# EAGLE schematic Keyboard (EAGLE 6.3)

## Sheet 1 of 3
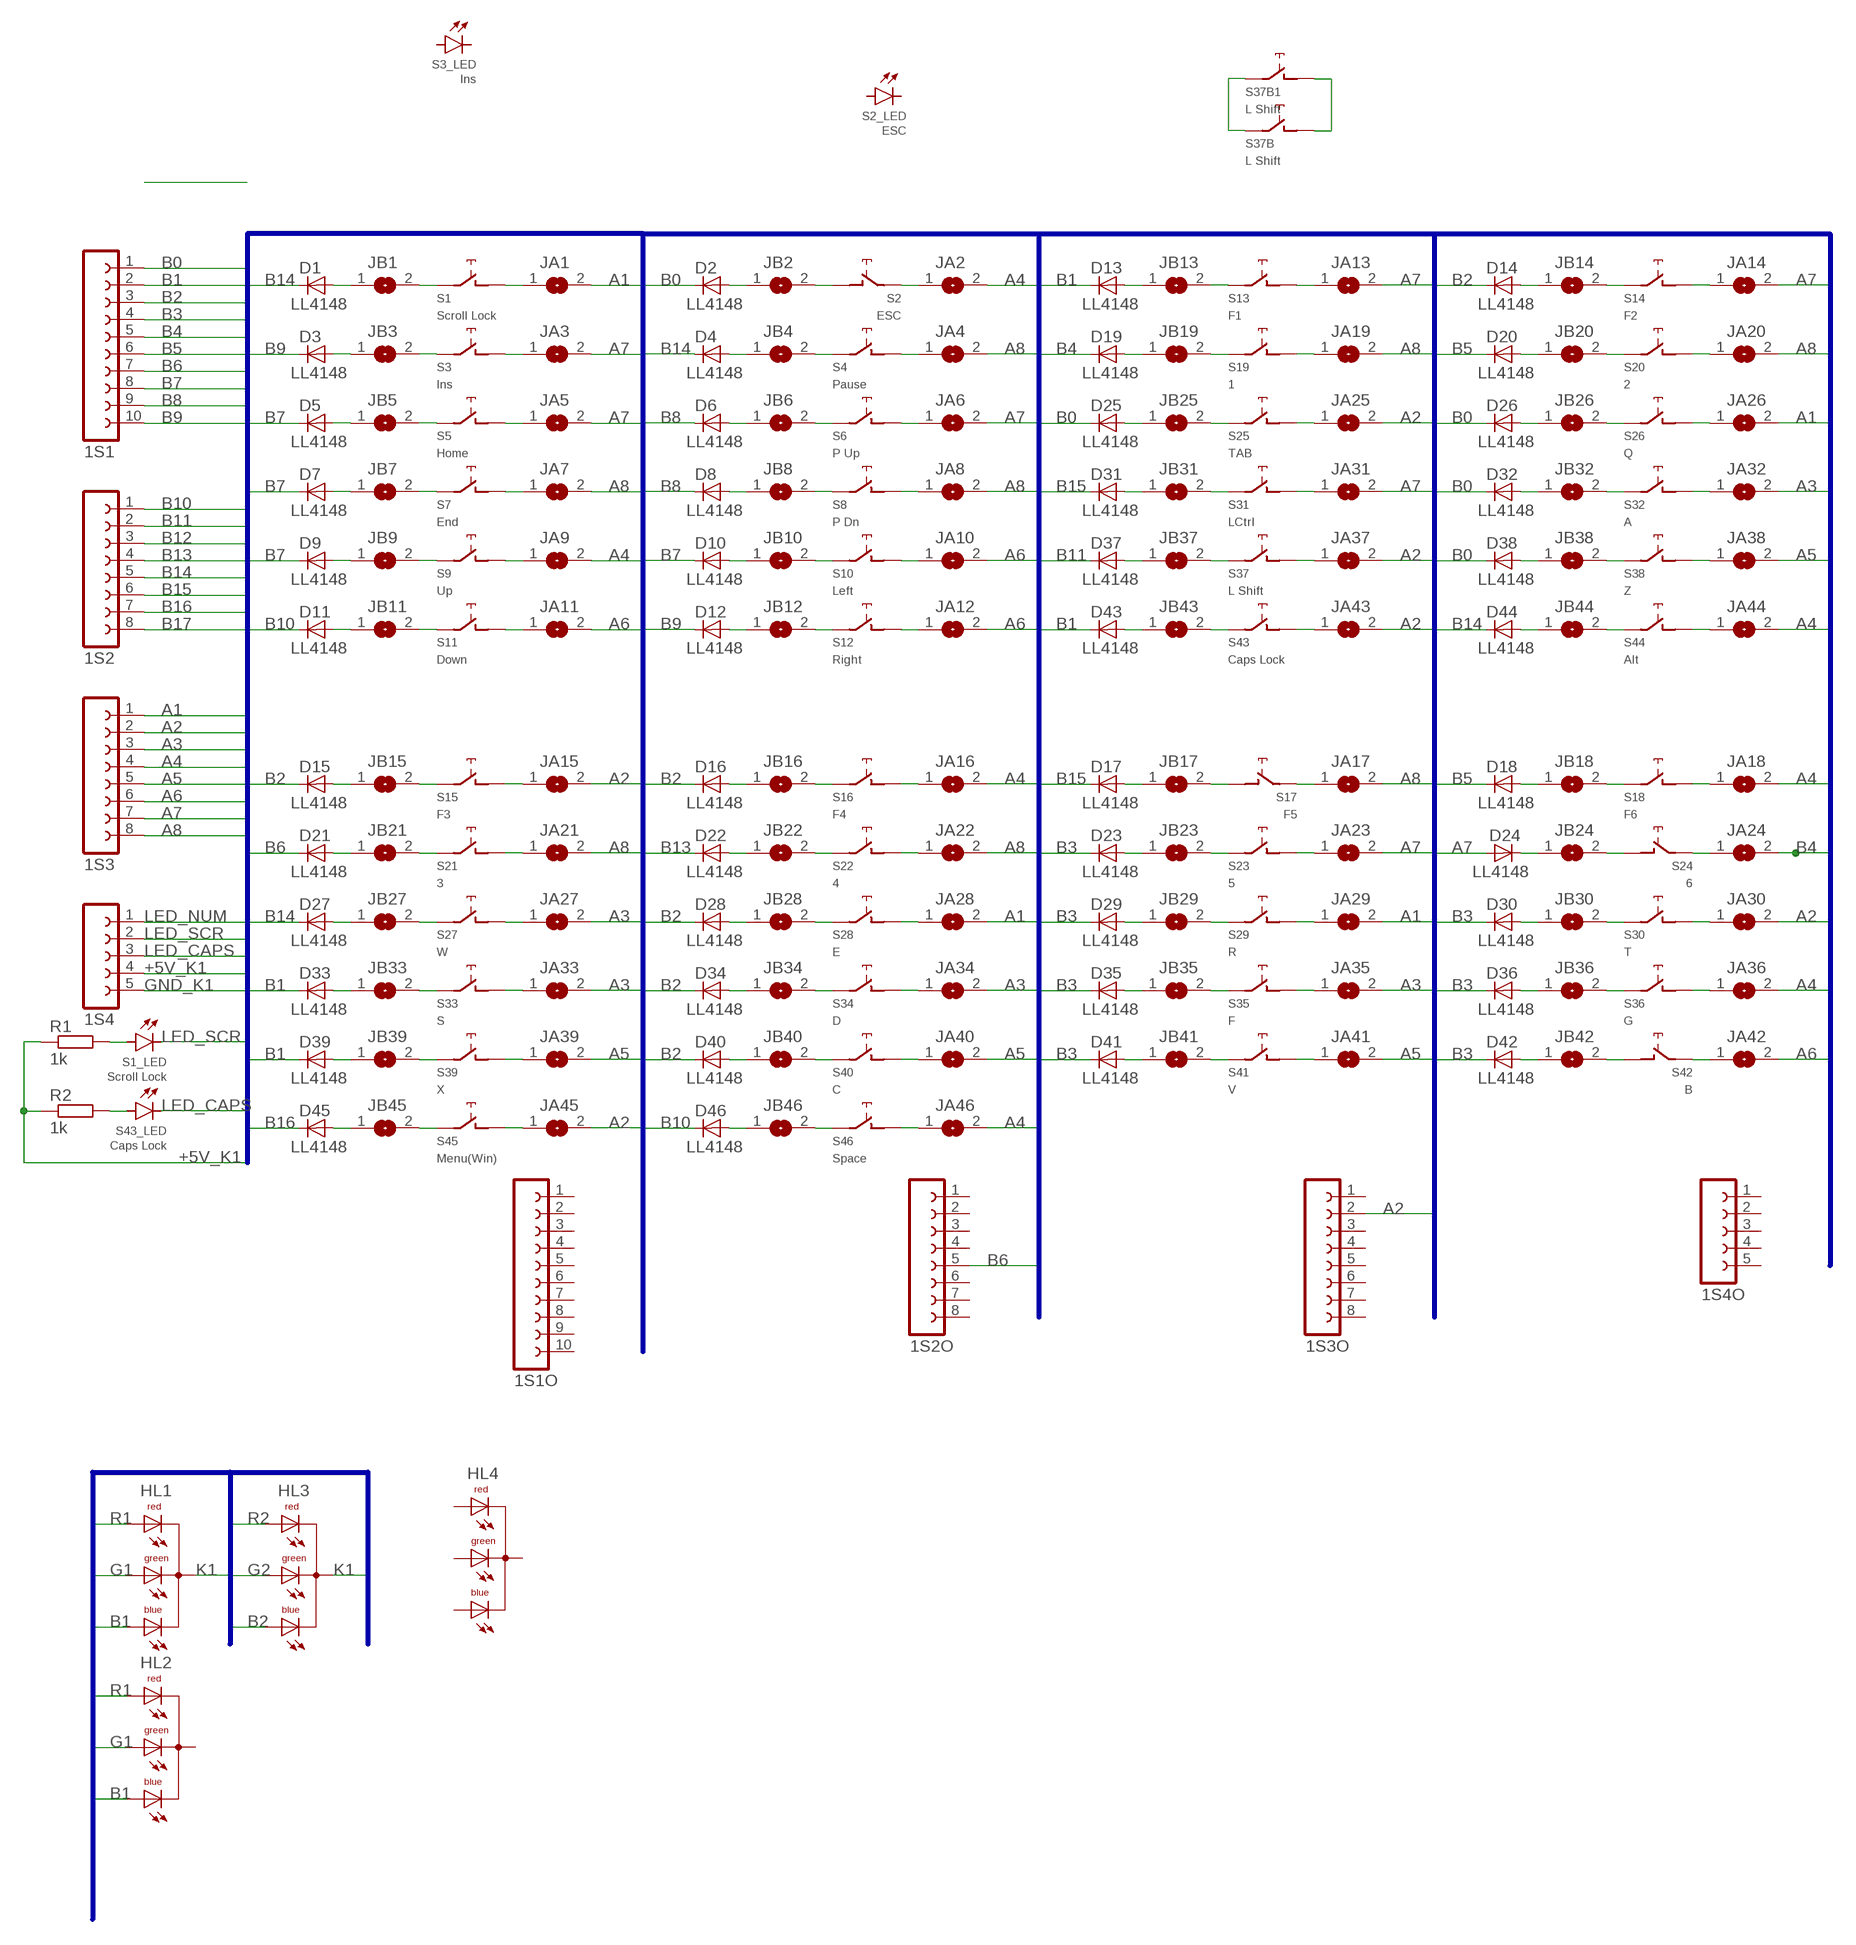
[diagram p0: schematic, sheet 1, part 1 of 2]
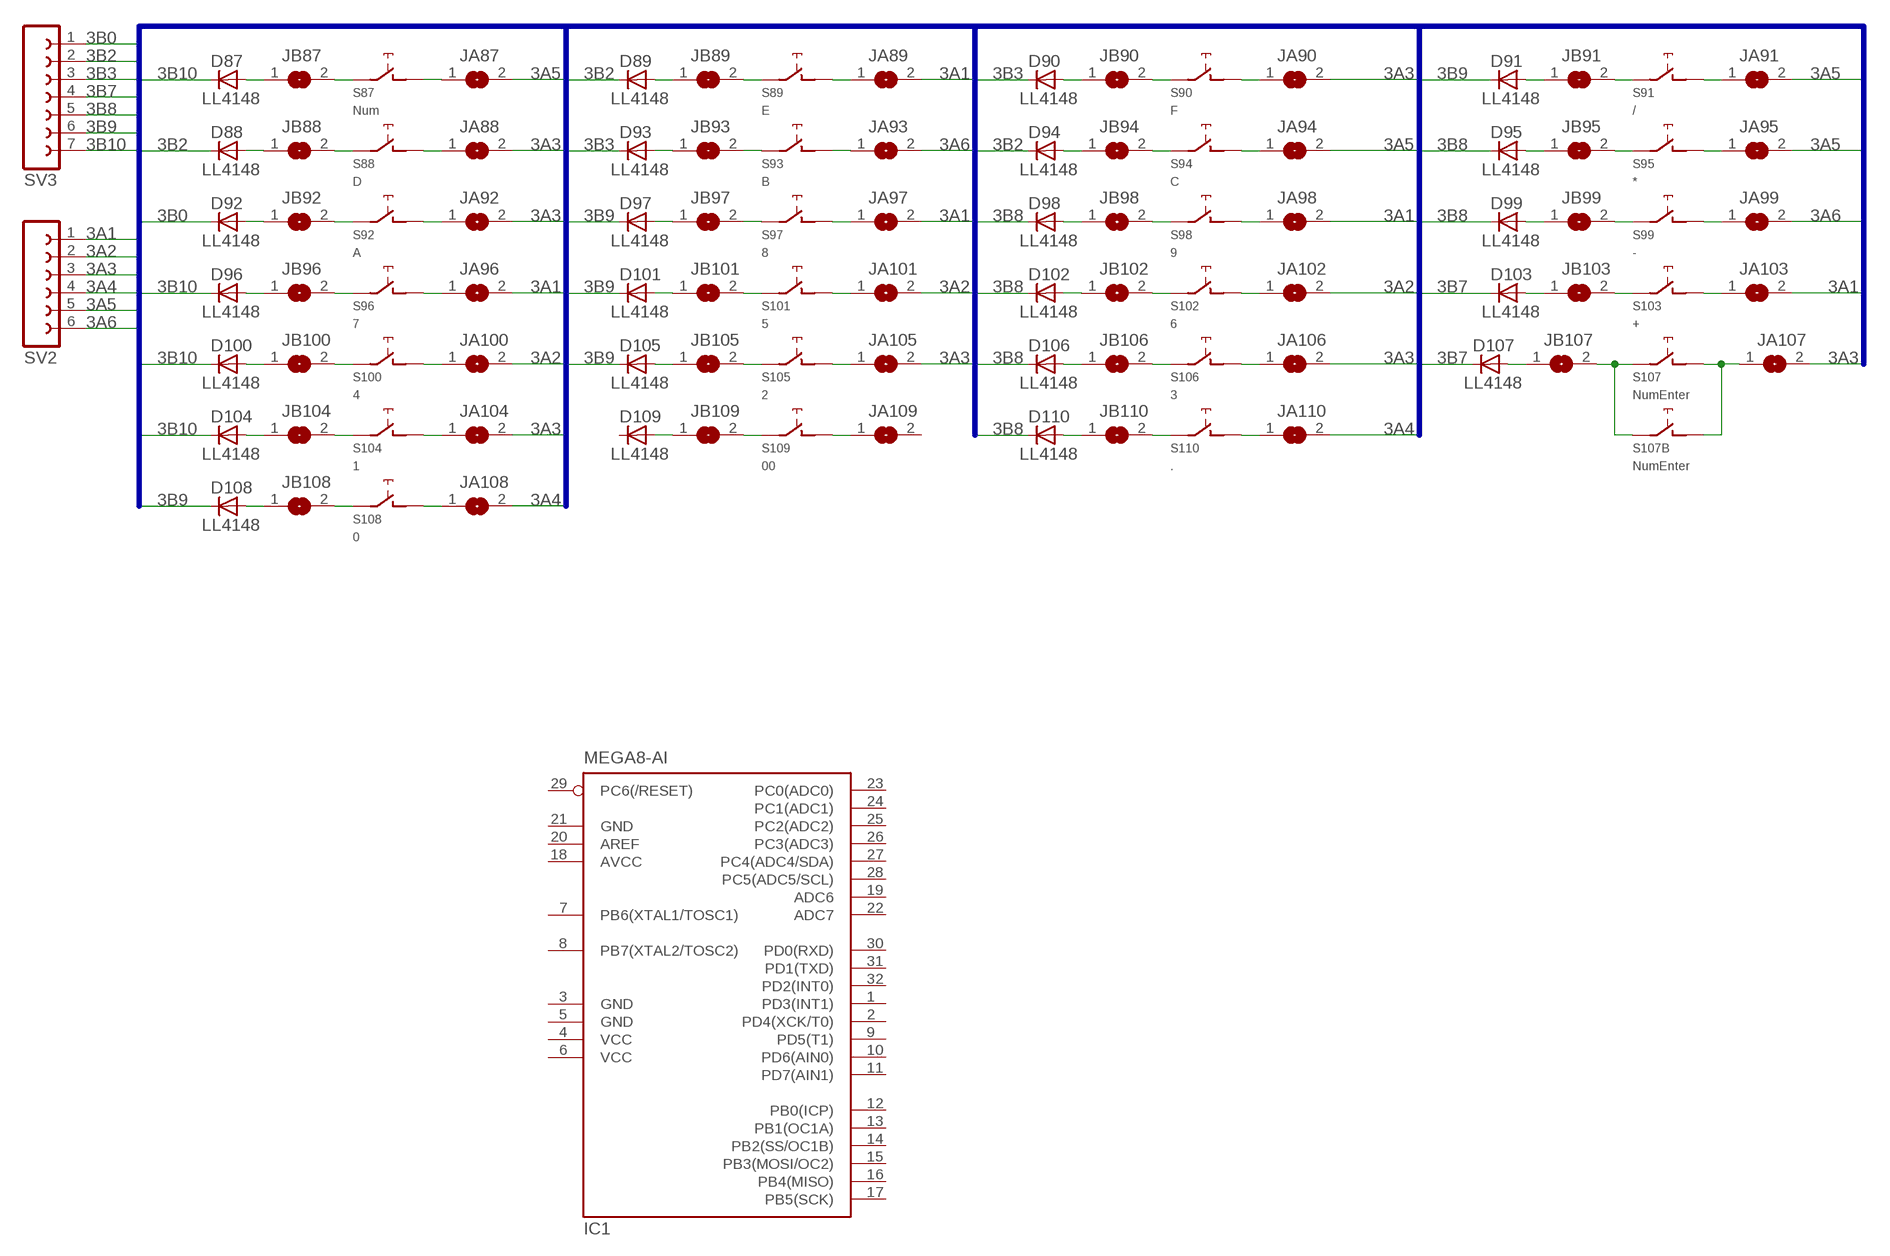
[diagram p1: schematic, sheet 1, part 2 of 2]

### Parts
1S1  FE10-1  [FE10]
1S1O  FE10-1  [FE10]
1S2  FE08-1  [FE08]
1S2O  FE08-1  [FE08]
1S3  FE08-1  [FE08]
1S3O  FE08-1  [FE08]
1S4  FE05-1  [FE05-1]
1S4O  FE05-1  [FE05-1]
D1  LL4148  [SOD80C]
D2  LL4148  [SOD80C]
D3  LL4148  [SOD80C]
D4  LL4148  [SOD80C]
D5  LL4148  [SOD80C]
D6  LL4148  [SOD80C]
D7  LL4148  [SOD80C]
D8  LL4148  [SOD80C]
D9  LL4148  [SOD80C]
D10  LL4148  [SOD80C]
D11  LL4148  [SOD80C]
D12  LL4148  [SOD80C]
D13  LL4148  [SOD80C]
D14  LL4148  [SOD80C]
D15  LL4148  [SOD80C]
D16  LL4148  [SOD80C]
D17  LL4148  [SOD80C]
D18  LL4148  [SOD80C]
D19  LL4148  [SOD80C]
D20  LL4148  [SOD80C]
D21  LL4148  [SOD80C]
D22  LL4148  [SOD80C]
D23  LL4148  [SOD80C]
D24  LL4148  [SOD80C]
D25  LL4148  [SOD80C]
D26  LL4148  [SOD80C]
D27  LL4148  [SOD80C]
D28  LL4148  [SOD80C]
D29  LL4148  [SOD80C]
D30  LL4148  [SOD80C]
D31  LL4148  [SOD80C]
D32  LL4148  [SOD80C]
D33  LL4148  [SOD80C]
D34  LL4148  [SOD80C]
D35  LL4148  [SOD80C]
D36  LL4148  [SOD80C]
D37  LL4148  [SOD80C]
D38  LL4148  [SOD80C]
D39  LL4148  [SOD80C]
D40  LL4148  [SOD80C]
D41  LL4148  [SOD80C]
D42  LL4148  [SOD80C]
D43  LL4148  [SOD80C]
D44  LL4148  [SOD80C]
D45  LL4148  [SOD80C]
D46  LL4148  [SOD80C]
D87  LL4148  [SOD80C]
D88  LL4148  [SOD80C]
D89  LL4148  [SOD80C]
D90  LL4148  [SOD80C]
D91  LL4148  [SOD80C]
D92  LL4148  [SOD80C]
D93  LL4148  [SOD80C]
D94  LL4148  [SOD80C]
D95  LL4148  [SOD80C]
D96  LL4148  [SOD80C]
D97  LL4148  [SOD80C]
D98  LL4148  [SOD80C]
D99  LL4148  [SOD80C]
D100  LL4148  [SOD80C]
D101  LL4148  [SOD80C]
D102  LL4148  [SOD80C]
D103  LL4148  [SOD80C]
D104  LL4148  [SOD80C]
D105  LL4148  [SOD80C]
D106  LL4148  [SOD80C]
D107  LL4148  [SOD80C]
D108  LL4148  [SOD80C]
D109  LL4148  [SOD80C]
D110  LL4148  [SOD80C]
HL1  RGB2X5  [RGB2X5]
HL2  RGB2X5  [RGB2X5]
HL3  RGB2X5  [RGB2X5]
HL4  RGB2X5  [RGB2X5]
IC1  MEGA8-AI  [TQFP32-08]
JA1  SJ  [SJ@1]
JA2  SJ  [SJ@1]
JA3  SJ  [SJ@1]
JA4  SJ  [SJ@1]
JA5  SJ  [SJ@1]
JA6  SJ  [SJ@1]
JA7  SJ  [SJ@1]
JA8  SJ  [SJ@1]
JA9  SJ  [SJ@1]
JA10  SJ  [SJ@1]
JA11  SJ  [SJ@1]
JA12  SJ  [SJ@1]
JA13  SJ  [SJ]
JA14  SJ  [SJ]
JA15  SJ  [SJ]
JA16  SJ  [SJ]
JA17  SJ  [SJ]
JA18  SJ  [SJ]
JA19  SJ  [SJ]
JA20  SJ  [SJ]
JA21  SJ  [SJ]
JA22  SJ  [SJ]
JA23  SJ  [SJ]
JA24  SJ  [SJ]
JA25  SJ  [SJ]
JA26  SJ  [SJ]
JA27  SJ  [SJ]
JA28  SJ  [SJ]
JA29  SJ  [SJ]
JA30  SJ  [SJ]
JA31  SJ  [SJ]
JA32  SJ  [SJ]
JA33  SJ  [SJ]
JA34  SJ  [SJ]
JA35  SJ  [SJ]
JA36  SJ  [SJ]
JA37  SJ  [SJ]
JA38  SJ  [SJ]
JA39  SJ  [SJ]
JA40  SJ  [SJ]
JA41  SJ  [SJ]
JA42  SJ  [SJ]
JA43  SJ  [SJ]
JA44  SJ  [SJ]
JA45  SJ  [SJ]
JA46  SJ  [SJ]
JA87  SJ  [SJ]
JA88  SJ  [SJ]
JA89  SJ  [SJ]
JA90  SJ  [SJ]
JA91  SJ  [SJ]
JA92  SJ  [SJ]
JA93  SJ  [SJ]
JA94  SJ  [SJ]
JA95  SJ  [SJ]
JA96  SJ  [SJ]
JA97  SJ  [SJ]
JA98  SJ  [SJ]
JA99  SJ  [SJ]
JA100  SJ  [SJ]
JA101  SJ  [SJ]
JA102  SJ  [SJ]
JA103  SJ  [SJ]
JA104  SJ  [SJ]
JA105  SJ  [SJ]
JA106  SJ  [SJ]
JA107  SJ  [SJ]
JA108  SJ  [SJ]
JA109  SJ  [SJ]
JA110  SJ  [SJ]
JB1  SJ  [SJ]
JB2  SJ  [SJ@1]
JB3  SJ  [SJ]
JB4  SJ  [SJ@1]
JB5  SJ  [SJ@1]
JB6  SJ  [SJ@1]
JB7  SJ  [SJ@1]
JB8  SJ  [SJ@1]
JB9  SJ  [SJ@1]
JB10  SJ  [SJ@1]
JB11  SJ  [SJ@1]
JB12  SJ  [SJ@1]
JB13  SJ  [SJ@1]
JB14  SJ  [SJ@1]
JB15  SJ  [SJ@1]
JB16  SJ  [SJ@1]
JB17  SJ  [SJ@1]
JB18  SJ  [SJ]
JB19  SJ  [SJ]
JB20  SJ  [SJ]
JB21  SJ  [SJ]
JB22  SJ  [SJ]
JB23  SJ  [SJ]
JB24  SJ  [SJ]
JB25  SJ  [SJ]
JB26  SJ  [SJ]
JB27  SJ  [SJ]
JB28  SJ  [SJ]
JB29  SJ  [SJ]
JB30  SJ  [SJ]
JB31  SJ  [SJ]
JB32  SJ  [SJ]
JB33  SJ  [SJ]
JB34  SJ  [SJ]
JB35  SJ  [SJ]
JB36  SJ  [SJ]
JB37  SJ  [SJ]
JB38  SJ  [SJ]
JB39  SJ  [SJ]
JB40  SJ  [SJ]
JB41  SJ  [SJ]
JB42  SJ  [SJ]
JB43  SJ  [SJ]
JB44  SJ  [SJ]
JB45  SJ  [SJ]
JB46  SJ  [SJ]
JB87  SJ  [SJ]
JB88  SJ  [SJ]
JB89  SJ  [SJ]
JB90  SJ  [SJ]
JB91  SJ  [SJ]
JB92  SJ  [SJ]
JB93  SJ  [SJ]
JB94  SJ  [SJ]
JB95  SJ  [SJ]
JB96  SJ  [SJ]
JB97  SJ  [SJ]
JB98  SJ  [SJ]
JB99  SJ  [SJ]
JB100  SJ  [SJ]
JB101  SJ  [SJ]
JB102  SJ  [SJ]
JB103  SJ  [SJ]
JB104  SJ  [SJ]
JB105  SJ  [SJ]
JB106  SJ  [SJ]
JB107  SJ  [SJ]
JB108  SJ  [SJ]
JB109  SJ  [SJ]
JB110  SJ  [SJ]
R1  1k  R-EU_R1206W  [R1206W]
R2  1k  R-EU_R1206W  [R1206W]
S1  Scroll Lock  CHERRY-MX-LED  [CHERRY-MX-LED]
S2  ESC  CHERRY-MX-LED  [CHERRY-MX-LED]
S3  Ins  CHERRY-MX-LED  [CHERRY-MX-LED]
S4  Pause  CHERRY_MX  [CHERRY-MX@1]
S5  Home  CHERRY-MX  [CHERRY-MX]
S6  P Up  CHERRY-MX  [CHERRY-MX]
S7  End  CHERRY-MX  [CHERRY-MX]
S8  P Dn  CHERRY-MX  [CHERRY-MX]
S9  Up  CHERRY-MX  [CHERRY-MX]
S10  Left  CHERRY-MX  [CHERRY-MX]
S11  Down  CHERRY-MX  [CHERRY-MX]
S12  Right  CHERRY-MX  [CHERRY-MX]
S13  F1  CHERRY-MX  [CHERRY-MX]
S14  F2  CHERRY-MX  [CHERRY-MX]
S15  F3  CHERRY-MX  [CHERRY-MX]
S16  F4  CHERRY-MX  [CHERRY-MX]
S17  F5  CHERRY-MX  [CHERRY-MX]
S18  F6  CHERRY-MX  [CHERRY-MX]
S19  1  CHERRY-MX  [CHERRY-MX]
S20  2  CHERRY-MX  [CHERRY-MX]
S21  3  CHERRY-MX  [CHERRY-MX]
S22  4  CHERRY-MX  [CHERRY-MX]
S23  5  CHERRY-MX  [CHERRY-MX]
S24  6  CHERRY-MX  [CHERRY-MX]
S25  TAB  CHERRY-MX  [CHERRY-MX]
S26  Q  CHERRY-MX  [CHERRY-MX]
S27  W  CHERRY_MX  [CHERRY-MX@1]
S28  E  CHERRY-MX  [CHERRY-MX]
S29  R  CHERRY-MX  [CHERRY-MX]
S30  T  CHERRY-MX  [CHERRY-MX]
S31  LCtrl  CHERRY-MX  [CHERRY-MX]
S32  A  CHERRY-MX  [CHERRY-MX]
S33  S  CHERRY-MX  [CHERRY-MX]
S34  D  CHERRY-MX  [CHERRY-MX]
S35  F  CHERRY-MX  [CHERRY-MX]
S36  G  CHERRY-MX  [CHERRY-MX]
S37  L Shift  CHERRY-MX  [CHERRY-MX]
S37B  L Shift  CHERRY-MX  [CHERRY-MX]
S37B1  L Shift  CHERRY-MX  [CHERRY-MX]
S38  Z  CHERRY-MX  [CHERRY-MX]
S39  X  CHERRY-MX  [CHERRY-MX]
S40  C  CHERRY-MX  [CHERRY-MX]
S41  V  CHERRY-MX  [CHERRY-MX]
S42  B  CHERRY-MX  [CHERRY-MX]
S43  Caps Lock  CHERRY-MX-LED  [CHERRY-MX-LED]
S44  Alt  CHERRY-MX  [CHERRY-MX]
S45  Menu(Win)  CHERRY-MX  [CHERRY-MX]
S46  Space  CHERRY-MX  [CHERRY-MX]
S87  Num  CHERRY-MX-4P  [CHERRY-MX-4P]
S88  D  CHERRY-MX-4P  [CHERRY-MX-4P]
S89  E  CHERRY-MX-4P  [CHERRY-MX-4P]
S90  F  CHERRY-MX-4P  [CHERRY-MX-4P]
S91  /  CHERRY-MX-4P  [CHERRY-MX-4P]
S92  A  CHERRY-MX-4P  [CHERRY-MX-4P]
S93  B  CHERRY-MX-4P  [CHERRY-MX-4P]
S94  C  CHERRY-MX-4P  [CHERRY-MX-4P]
S95  *  CHERRY-MX-4P  [CHERRY-MX-4P]
S96  7  CHERRY-MX-4P  [CHERRY-MX-4P]
S97  8  CHERRY-MX-4P  [CHERRY-MX-4P]
S98  9  CHERRY-MX-4P  [CHERRY-MX-4P]
S99  -  CHERRY-MX-4P  [CHERRY-MX-4P]
S100  4  CHERRY-MX-4P  [CHERRY-MX-4P]
S101  5  CHERRY-MX-4P  [CHERRY-MX-4P]
S102  6  CHERRY-MX-4P  [CHERRY-MX-4P]
S103  +  CHERRY-MX-4P  [CHERRY-MX-4P]
S104  1  CHERRY-MX-4P  [CHERRY-MX-4P]
S105  2  CHERRY-MX-4P  [CHERRY-MX-4P]
S106  3  CHERRY-MX-4P  [CHERRY-MX-4P]
S107  NumEnter  CHERRY-MX-4P  [CHERRY-MX-4P]
S107B  NumEnter  CHERRY-MX  [CHERRY-MX]
S108  0  CHERRY-MX-4P  [CHERRY-MX-4P]
S109  00  CHERRY-MX-4P  [CHERRY-MX-4P]
S110  .  CHERRY-MX-4P  [CHERRY-MX-4P]
SV2  FE06-1  [FE06]
SV3  FE07-1  [FE07]

### Nets
3A1: JA89.2 JA96.2 JA97.2 JA98.2 JA103.2 SV2.1
3A2: JA100.2 JA101.2 JA102.2 SV2.2
3A3: JA88.2 JA90.2 JA92.2 JA104.2 JA105.2 JA106.2 JA107.2 SV2.3
3A4: JA108.2 JA110.2 SV2.4
3A5: JA87.2 JA91.2 JA94.2 JA95.2 SV2.5
3A6: JA93.2 JA99.2 SV2.6
3B0: D92.C SV3.1
3B2: D88.C D89.C D94.C SV3.2
3B3: D90.C D93.C SV3.3
3B7: D103.C D107.C SV3.4
3B8: D95.C D98.C D99.C D102.C D106.C D110.C SV3.5
3B9: D91.C D97.C D101.C D105.C D108.C SV3.6
3B10: D87.C D96.C D100.C D104.C SV3.7
+5V_K1: 1S4.4 R1.1 R2.1
A1: 1S3.1 JA1.2 JA26.2 JA28.2 JA29.2
A2: 1S3.2 1S3O.2 JA15.2 JA25.2 JA30.2 JA37.2 JA43.2 JA45.2
A3: 1S3.3 JA27.2 JA32.2 JA33.2 JA34.2 JA35.2
A4: 1S3.4 JA2.2 JA9.2 JA16.2 JA18.2 JA36.2 JA44.2 JA46.2
A5: 1S3.5 JA38.2 JA39.2 JA40.2 JA41.2
A6: 1S3.6 JA10.2 JA11.2 JA12.2 JA42.2
A7: 1S3.7 D24.A JA3.2 JA5.2 JA6.2 JA13.2 JA14.2 JA23.2 JA31.2
A8: 1S3.8 JA4.2 JA7.2 JA8.2 JA17.2 JA19.2 JA20.2 JA21.2 JA22.2
B0: 1S1.1 D2.C D25.C D26.C D32.C D38.C
B1: 1S1.2 D13.C D33.C D39.C D43.C HL1.4(AB) HL2.4(AB)
B2: 1S1.3 D14.C D15.C D16.C D28.C D34.C D40.C HL3.4(AB)
B3: 1S1.4 D23.C D29.C D30.C D35.C D36.C D41.C D42.C
B4: 1S1.5 D19.C JA24.2
B5: 1S1.6 D18.C D20.C
B6: 1S1.7 1S2O.5 D21.C
B7: 1S1.8 D5.C D7.C D9.C D10.C
B8: 1S1.9 D6.C D8.C
B9: 1S1.10 D3.C D12.C
B10: 1S2.1 D11.C D46.C
B11: 1S2.2 D37.C
B12: 1S2.3
B13: 1S2.4 D22.C
B14: 1S2.5 D1.C D4.C D27.C D44.C
B15: 1S2.6 D17.C D31.C
B16: 1S2.7 D45.C
B17: 1S2.8
G1: HL1.3(AG) HL2.3(AG) ; also sheet 3
G2: HL3.3(AG) ; also sheet 3
GND_K1: 1S4.5
K1: HL1.2(C) HL3.2(C)
LED_CAPS: 1S4.3 S43.LED2(_LED:LED2)
LED_NUM: 1S4.1
LED_SCR: 1S4.2 S1.LED2(_LED:LED2)
N$1: D15.A JB15.1
N$2: JB4.2 S4.SW1(PIN-1)
N$3: D1.A JB1.1
N$4: JA4.1 S4.SW2(PIN-2)
N$5: JB14.2 S14.SW1(PIN-1)
N$6: JB20.2 S20.SW1(PIN-1)
N$7: JB32.2 S32.SW1(PIN-1)
N$8: JB38.2 S38.SW1(PIN-1)
N$9: JB6.2 S6.SW1(PIN-1)
N$10: JA6.1 S6.SW2(PIN-2)
N$11: JA8.1 S8.SW2(PIN-2)
N$12: JB8.2 S8.SW1(PIN-1)
N$13: JB10.2 S10.SW1(PIN-1)
N$14: JB1.2 S1.SW1(PIN-1)
N$15: D2.A JB2.1
N$16: JB2.2 S2.SW2(PIN-2)
N$17: JA2.1 S2.SW1(PIN-1)
N$18: D16.A JB16.1
N$19: JB3.2 S3.SW1(PIN-1)
N$20: JB5.2 S5.SW1(PIN-1)
N$21: JB7.2 S7.SW1(PIN-1)
N$22: JB9.2 S9.SW1(PIN-1)
N$23: JB11.2 S11.SW1(PIN-1)
N$24: D3.A JB3.1
N$25: JB12.2 S12.SW1(PIN-1)
N$26: D5.A JB5.1
N$27: D7.A JB7.1
N$28: JA10.1 S10.SW2(PIN-2)
N$29: JA1.1 S1.SW2(PIN-2)
N$30: D9.A JB9.1
N$31: D11.A JB11.1
N$32: JA3.1 S3.SW2(PIN-2)
N$33: JA5.1 S5.SW2(PIN-2)
N$34: JA7.1 S7.SW2(PIN-2)
N$35: JA9.1 S9.SW2(PIN-2)
N$36: JA11.1 S11.SW2(PIN-2)
N$37: JA12.1 S12.SW2(PIN-2)
N$38: JA14.1 S14.SW2(PIN-2)
N$39: JB13.2 S13.SW1(PIN-1)
N$40: JA13.1 S13.SW2(PIN-2)
N$41: D14.A JB14.1
N$42: JB42.2 S42.SW2(PIN-2)
N$43: JA42.1 S42.SW1(PIN-1)
N$44: JB27.2 S27.SW1(PIN-1)
N$45: JA27.1 S27.SW2(PIN-2)
N$46: JB17.2 S17.SW2(PIN-2)
N$47: JA17.1 S17.SW1(PIN-1)
N$48: D24.C JB24.1
N$49: JB24.2 S24.SW2(PIN-2)
N$50: JA24.1 S24.SW1(PIN-1)
N$51: JA107.1 S107.SW2(PIN-2) S107B.SW2(PIN-2)
N$52: D4.A JB4.1
N$53: D6.A JB6.1
N$54: D8.A JB8.1
N$55: D10.A JB10.1
N$56: D12.A JB12.1
N$57: D13.A JB13.1
N$58: JB19.2 S19.SW1(PIN-1)
N$59: JB25.2 S25.SW1(PIN-1)
N$60: D104.A JB104.1
N$61: JB31.2 S31.SW1(PIN-1)
N$62: JB37.2 S37.SW1(PIN-1) S37B1.SW1(PIN-1) S37B.SW1(PIN-1)
N$63: JB43.2 S43.SW1(PIN-1)
N$64: JB26.2 S26.SW1(PIN-1)
N$65: JB44.2 S44.SW1(PIN-1)
N$66: JB18.2 S18.SW1(PIN-1)
N$68: JB30.2 S30.SW1(PIN-1)
N$69: JB36.2 S36.SW1(PIN-1)
N$72: JB23.2 S23.SW1(PIN-1)
N$73: JB29.2 S29.SW1(PIN-1)
N$74: JB35.2 S35.SW1(PIN-1)
N$75: JB41.2 S41.SW1(PIN-1)
N$76: JB16.2 S16.SW1(PIN-1)
N$77: JB22.2 S22.SW1(PIN-1)
N$78: JB28.2 S28.SW1(PIN-1)
N$79: JB34.2 S34.SW1(PIN-1)
N$80: JB40.2 S40.SW1(PIN-1)
N$81: JB46.2 S46.SW1(PIN-1)
N$82: JB15.2 S15.SW1(PIN-1)
N$83: JB21.2 S21.SW1(PIN-1)
N$85: JB33.2 S33.SW1(PIN-1)
N$86: JB39.2 S39.SW1(PIN-1)
N$87: JB45.2 S45.SW1(PIN-1)
N$88: JA15.1 S15.SW2(PIN-2)
N$90: JA18.1 S18.SW2(PIN-2)
N$91: JA20.1 S20.SW2(PIN-2)
N$92: JA22.1 S22.SW2(PIN-2)
N$93: JA23.1 S23.SW2(PIN-2)
N$95: JA25.1 S25.SW2(PIN-2)
N$96: JA26.1 S26.SW2(PIN-2)
N$98: JA28.1 S28.SW2(PIN-2)
N$99: JA29.1 S29.SW2(PIN-2)
N$100: JA30.1 S30.SW2(PIN-2)
N$101: JA31.1 S31.SW2(PIN-2)
N$102: JA32.1 S32.SW2(PIN-2)
N$103: JA33.1 S33.SW2(PIN-2)
N$104: JA34.1 S34.SW2(PIN-2)
N$105: JA35.1 S35.SW2(PIN-2)
N$106: JA36.1 S36.SW2(PIN-2)
N$107: JA37.1 S37.SW2(PIN-2) S37B1.SW2(PIN-2) S37B.SW2(PIN-2)
N$108: JA38.1 S38.SW2(PIN-2)
N$109: JA39.1 S39.SW2(PIN-2)
N$110: JA40.1 S40.SW2(PIN-2)
N$111: JA41.1 S41.SW2(PIN-2)
N$113: JA43.1 S43.SW2(PIN-2)
N$114: JA45.1 S45.SW2(PIN-2)
N$115: JA46.1 S46.SW2(PIN-2)
N$116: JA19.1 S19.SW2(PIN-2)
N$117: JA44.1 S44.SW2(PIN-2)
N$118: JA21.1 S21.SW2(PIN-2)
N$119: JA16.1 S16.SW2(PIN-2)
N$120: D17.A JB17.1
N$121: D18.A JB18.1
N$122: D19.A JB19.1
N$123: D20.A JB20.1
N$124: D21.A JB21.1
N$125: D22.A JB22.1
N$126: D23.A JB23.1
N$128: D25.A JB25.1
N$129: D26.A JB26.1
N$130: D27.A JB27.1
N$131: D28.A JB28.1
N$132: D29.A JB29.1
N$133: D30.A JB30.1
N$134: D31.A JB31.1
N$135: D32.A JB32.1
N$136: D33.A JB33.1
N$137: D34.A JB34.1
N$138: D35.A JB35.1
N$139: D36.A JB36.1
N$140: D37.A JB37.1
N$141: D38.A JB38.1
N$142: D39.A JB39.1
N$143: D40.A JB40.1
N$144: D41.A JB41.1
N$145: D42.A JB42.1
N$146: D43.A JB43.1
N$147: D44.A JB44.1
N$148: D45.A JB45.1
N$149: D46.A JB46.1
N$150: R1.2 S1.LED1(_LED:LED1)
N$151: R2.2 S43.LED1(_LED:LED1)
N$268: D87.A JB87.1
N$269: D88.A JB88.1
N$270: JB87.2 S87.SW1(PIN-1)
N$271: JB88.2 S88.SW1(PIN-1)
N$272: JA87.1 S87.SW2(PIN-2)
N$273: JA88.1 S88.SW2(PIN-2)
N$274: D89.A JB89.1
N$275: JB89.2 S89.SW1(PIN-1)
N$276: JA89.1 S89.SW2(PIN-2)
N$277: D90.A JB90.1
N$278: JB90.2 S90.SW1(PIN-1)
N$279: JA90.1 S90.SW2(PIN-2)
N$280: D91.A JB91.1
N$281: JB91.2 S91.SW1(PIN-1)
N$282: JA91.1 S91.SW2(PIN-2)
N$283: JB92.2 S92.SW1(PIN-1)
N$284: D92.A JB92.1
N$285: JA92.1 S92.SW2(PIN-2)
N$286: JA93.1 S93.SW2(PIN-2)
N$287: JB93.2 S93.SW1(PIN-1)
N$288: D93.A JB93.1
N$289: D94.A JB94.1
N$290: JB94.2 S94.SW1(PIN-1)
N$291: JA94.1 S94.SW2(PIN-2)
N$292: D95.A JB95.1
N$293: JB95.2 S95.SW1(PIN-1)
N$294: JA95.1 S95.SW2(PIN-2)
N$295: D96.A JB96.1
N$296: JB96.2 S96.SW1(PIN-1)
N$297: JA96.1 S96.SW2(PIN-2)
N$298: JB97.2 S97.SW1(PIN-1)
N$299: JA97.1 S97.SW2(PIN-2)
N$300: D97.A JB97.1
N$301: D98.A JB98.1
N$302: JB98.2 S98.SW1(PIN-1)
N$303: JA98.1 S98.SW2(PIN-2)
N$304: D99.A JB99.1
N$305: JB99.2 S99.SW1(PIN-1)
N$306: JA99.1 S99.SW2(PIN-2)
N$307: D100.A JB100.1
N$308: JB100.2 S100.SW1(PIN-1)
N$309: JA100.1 S100.SW2(PIN-2)
N$310: JB101.2 S101.SW1(PIN-1)
N$311: D101.A JB101.1
N$312: JA101.1 S101.SW2(PIN-2)
N$313: D102.A JB102.1
N$314: JB102.2 S102.SW1(PIN-1)
N$315: JA102.1 S102.SW2(PIN-2)
N$316: D103.A JB103.1
N$317: JB103.2 S103.SW1(PIN-1)
N$318: JA103.1 S103.SW2(PIN-2)
N$319: JB107.2 S107.SW1(PIN-1) S107B.SW1(PIN-1)
N$320: JB104.2 S104.SW1(PIN-1)
N$321: JA104.1 S104.SW2(PIN-2)
N$322: JB105.2 S105.SW1(PIN-1)
N$323: D105.A JB105.1
N$324: JA105.1 S105.SW2(PIN-2)
N$325: D106.A JB106.1
N$326: JB106.2 S106.SW1(PIN-1)
N$327: JA106.1 S106.SW2(PIN-2)
N$328: D107.A JB107.1
N$329: JB108.2 S108.SW1(PIN-1)
N$330: JA108.1 S108.SW2(PIN-2)
N$331: D108.A JB108.1
N$332: JB109.2 S109.SW1(PIN-1)
N$333: D109.A JB109.1
N$334: JA109.1 S109.SW2(PIN-2)
N$335: D110.A JB110.1
N$336: JB110.2 S110.SW1(PIN-1)
N$337: JA110.1 S110.SW2(PIN-2)
R1: HL1.1(AR) HL2.1(AR)
R2: HL3.1(AR)
Unconnected: 1S1O.1 1S1O.2 1S1O.3 1S1O.4 1S1O.5 1S1O.6 1S1O.7 1S1O.8 1S1O.9 1S1O.10 1S2O.1 1S2O.2 1S2O.3 1S2O.4 1S2O.6 1S2O.7 1S2O.8 1S3O.1 1S3O.3 1S3O.4 1S3O.5 1S3O.6 1S3O.7 1S3O.8 1S4O.1 1S4O.2 1S4O.3 1S4O.4 1S4O.5 D109.C HL2.2(C) HL4.1(AR) HL4.2(C) HL4.3(AG) HL4.4(AB) IC1.1(PD3(INT1)) IC1.2(PD4(XCK/T0)) IC1.7(PB6(XTAL1/TOSC1)) IC1.8(PB7(XTAL2/TOSC2)) IC1.9(PD5(T1)) IC1.10(PD6(AIN0)) IC1.11(PD7(AIN1)) IC1.12(PB0(ICP)) IC1.13(PB1(OC1A)) IC1.14(PB2(SS/OC1B)) IC1.15(PB3(MOSI/OC2)) IC1.16(PB4(MISO)) IC1.17(PB5(SCK)) IC1.19(ADC6) IC1.20(AREF) IC1.22(ADC7) IC1.23(PC0(ADC0)) IC1.24(PC1(ADC1)) IC1.25(PC2(ADC2)) IC1.26(PC3(ADC3)) IC1.27(PC4(ADC4/SDA)) IC1.28(PC5(ADC5/SCL)) IC1.29(PC6(/RESET)) IC1.30(PD0(RXD)) IC1.31(PD1(TXD)) IC1.32(PD2(INT0)) JA109.2 S2.LED1(_LED:LED1) S2.LED2(_LED:LED2) S3.LED1(_LED:LED1) S3.LED2(_LED:LED2) S87.D1(_D:D1) S87.D2(_D:D2) S87.LED1(_L:LED1) S87.LED2(_L:LED2) S88.D1(_D:D1) S88.D2(_D:D2) S88.LED1(_L:LED1) S88.LED2(_L:LED2) S89.D1(_D:D1) S89.D2(_D:D2) S89.LED1(_L:LED1) S89.LED2(_L:LED2) S90.D1(_D:D1) S90.D2(_D:D2) S90.LED1(_L:LED1) S90.LED2(_L:LED2) S91.D1(_D:D1) S91.D2(_D:D2) S91.LED1(_L:LED1) S91.LED2(_L:LED2) S92.D1(_D:D1) S92.D2(_D:D2) S92.LED1(_L:LED1) S92.LED2(_L:LED2) S93.D1(_D:D1) S93.D2(_D:D2) S93.LED1(_L:LED1) S93.LED2(_L:LED2) S94.D1(_D:D1) S94.D2(_D:D2) S94.LED1(_L:LED1) S94.LED2(_L:LED2) S95.D1(_D:D1) S95.D2(_D:D2) S95.LED1(_L:LED1) S95.LED2(_L:LED2) S96.D1(_D:D1) S96.D2(_D:D2) S96.LED1(_L:LED1) S96.LED2(_L:LED2) S97.D1(_D:D1) S97.D2(_D:D2) S97.LED1(_L:LED1) S97.LED2(_L:LED2) S98.D1(_D:D1) S98.D2(_D:D2) S98.LED1(_L:LED1) S98.LED2(_L:LED2) S99.D1(_D:D1) S99.D2(_D:D2) S99.LED1(_L:LED1) S99.LED2(_L:LED2) S100.D1(_D:D1) S100.D2(_D:D2) S100.LED1(_L:LED1) S100.LED2(_L:LED2) S101.D1(_D:D1) S101.D2(_D:D2) S101.LED1(_L:LED1) S101.LED2(_L:LED2) S102.D1(_D:D1) S102.D2(_D:D2) S102.LED1(_L:LED1) S102.LED2(_L:LED2) S103.D1(_D:D1) S103.D2(_D:D2) S103.LED1(_L:LED1) S103.LED2(_L:LED2) S104.D1(_D:D1) S104.D2(_D:D2) S104.LED1(_L:LED1) S104.LED2(_L:LED2) S105.D1(_D:D1) S105.D2(_D:D2) S105.LED1(_L:LED1) S105.LED2(_L:LED2) S106.D1(_D:D1) S106.D2(_D:D2) S106.LED1(_L:LED1) S106.LED2(_L:LED2) S107.D1(_D:D1) S107.D2(_D:D2) S107.LED1(_L:LED1) S107.LED2(_L:LED2) S108.D1(_D:D1) S108.D2(_D:D2) S108.LED1(_L:LED1) S108.LED2(_L:LED2) S109.D1(_D:D1) S109.D2(_D:D2) S109.LED1(_L:LED1) S109.LED2(_L:LED2) S110.D1(_D:D1) S110.D2(_D:D2) S110.LED1(_L:LED1) S110.LED2(_L:LED2)

### Buses
A[1..8],B[0..17],LED_NUM,LED_CAPS,LED_SCR,+5V_K1,GND_K1
3A[1..8],3B[0..17],3LED_NUM,3LED_CAPS,3LED_SCR,+5V_K3,GND_K3
R[1..8],G[1..8],B[1..8],K[1..8]

## Sheet 2 of 3
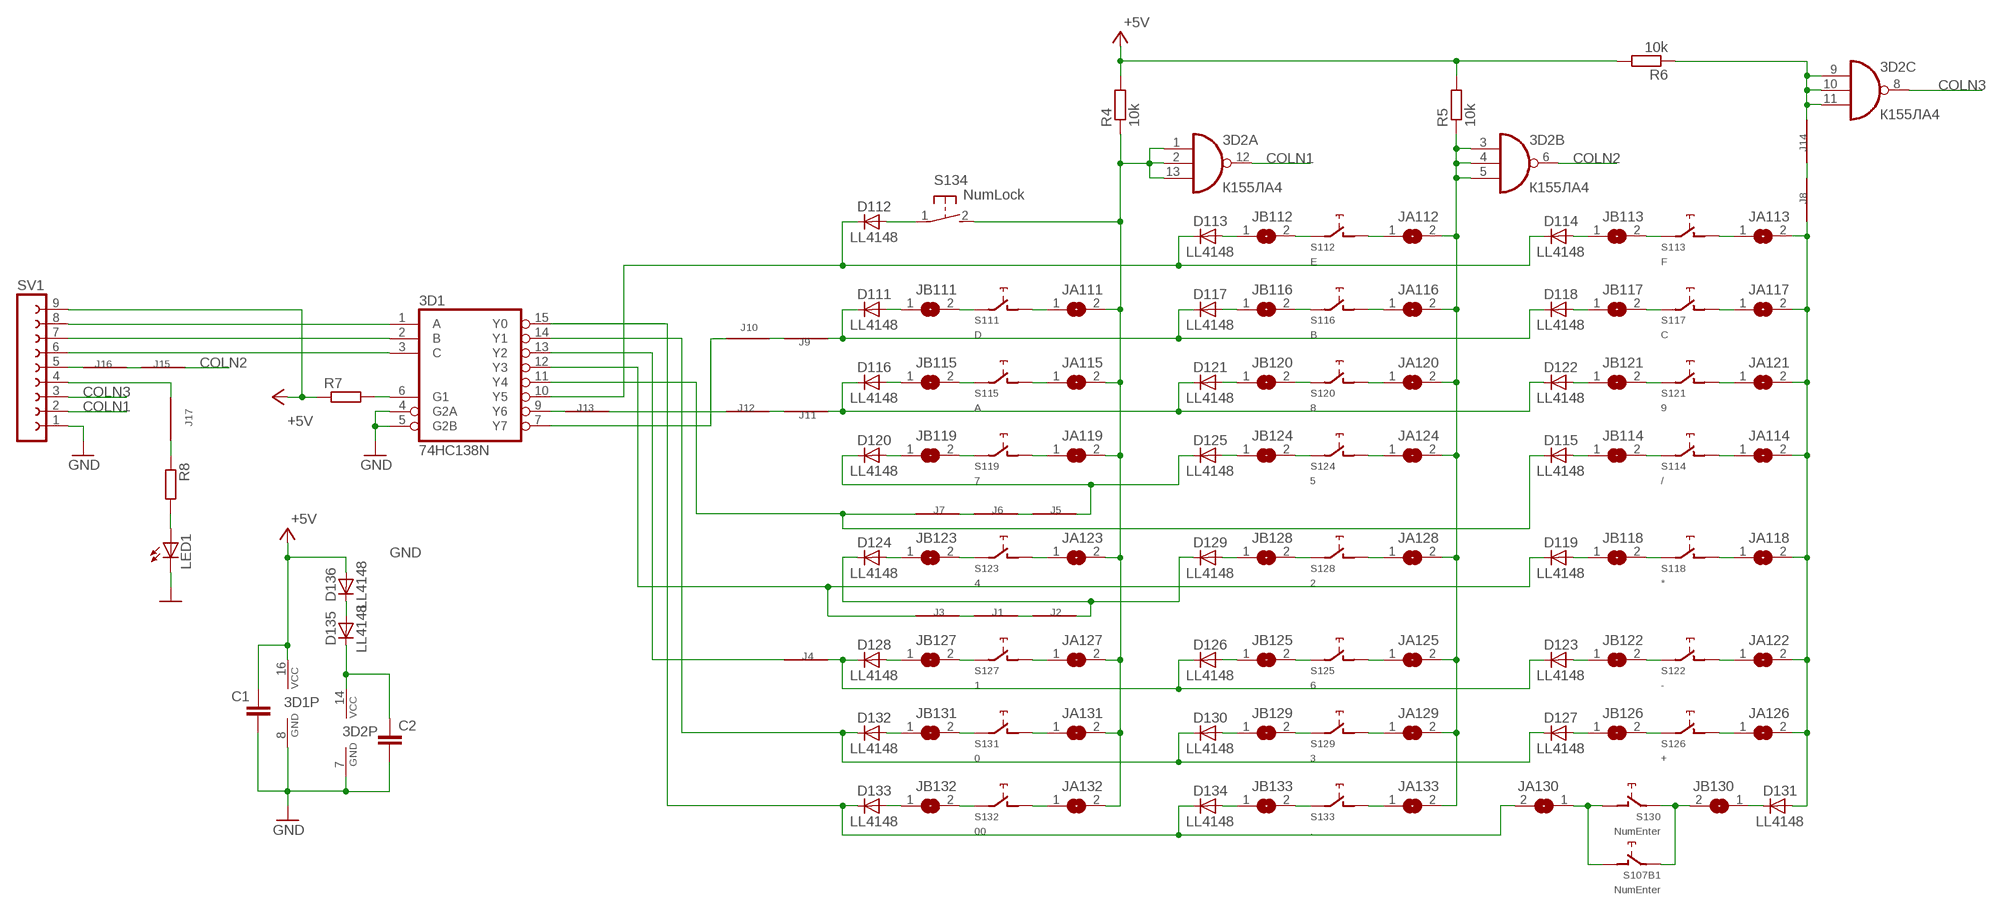
[diagram p2: schematic, sheet 2]

### Parts
3D1  74HC138N  [DIL16]
3D2  К155ЛА4  74HC10N  [DIL14]
C1  C-EUC1206  [C1206]
C2  C-EUC1206  [C1206]
D111  LL4148  [SOD80C]
D112  LL4148  [SOD80C]
D113  LL4148  [SOD80C]
D114  LL4148  [SOD80C]
D115  LL4148  [SOD80C]
D116  LL4148  [SOD80C]
D117  LL4148  [SOD80C]
D118  LL4148  [SOD80C]
D119  LL4148  [SOD80C]
D120  LL4148  [SOD80C]
D121  LL4148  [SOD80C]
D122  LL4148  [SOD80C]
D123  LL4148  [SOD80C]
D124  LL4148  [SOD80C]
D125  LL4148  [SOD80C]
D126  LL4148  [SOD80C]
D127  LL4148  [SOD80C]
D128  LL4148  [SOD80C]
D129  LL4148  [SOD80C]
D130  LL4148  [SOD80C]
D131  LL4148  [SOD80C]
D132  LL4148  [SOD80C]
D133  LL4148  [SOD80C]
D134  LL4148  [SOD80C]
D135  LL4148  [SOD80C]
D136  LL4148  [SOD80C]
J1  J  [R1206W]
J2  J  [R1206W]
J3  J  [R1206W]
J4  J  [R1206W]
J5  J  [R1206W]
J6  J  [R1206W]
J7  J  [R1206W]
J8  J  [R1206W]
J9  J  [R1206W]
J10  J  [R1206W]
J11  J  [R1206W]
J12  J  [R1206W]
J13  J  [R1206W]
J14  J  [R1206W]
J15  J  [R1206W]
J16  J  [R1206W]
J17  J  [R1206W]
JA111  SJ  [SJ]
JA112  SJ  [SJ]
JA113  SJ  [SJ]
JA114  SJ  [SJ]
JA115  SJ  [SJ]
JA116  SJ  [SJ]
JA117  SJ  [SJ]
JA118  SJ  [SJ]
JA119  SJ  [SJ]
JA120  SJ  [SJ]
JA121  SJ  [SJ]
JA122  SJ  [SJ]
JA123  SJ  [SJ]
JA124  SJ  [SJ]
JA125  SJ  [SJ]
JA126  SJ  [SJ]
JA127  SJ  [SJ]
JA128  SJ  [SJ]
JA129  SJ  [SJ]
JA130  SJ  [SJ]
JA131  SJ  [SJ]
JA132  SJ  [SJ]
JA133  SJ  [SJ]
JB111  SJ  [SJ]
JB112  SJ  [SJ]
JB113  SJ  [SJ]
JB114  SJ  [SJ]
JB115  SJ  [SJ]
JB116  SJ  [SJ]
JB117  SJ  [SJ]
JB118  SJ  [SJ]
JB119  SJ  [SJ]
JB120  SJ  [SJ]
JB121  SJ  [SJ]
JB122  SJ  [SJ]
JB123  SJ  [SJ]
JB124  SJ  [SJ]
JB125  SJ  [SJ]
JB126  SJ  [SJ]
JB127  SJ  [SJ]
JB128  SJ  [SJ]
JB129  SJ  [SJ]
JB130  SJ  [SJ]
JB131  SJ  [SJ]
JB132  SJ  [SJ]
JB133  SJ  [SJ]
LED1  LED5MM  [LED5MM]
R4  10k  R-EU_R1206W  [R1206W]
R5  10k  R-EU_R1206W  [R1206W]
R6  10k  R-EU_R1206W  [R1206W]
R7  R-EU_R1206W  [R1206W]
R8  R-EU_R1206W  [R1206W]
S107B1  NumEnter  CHERRY-MX-4P  [CHERRY-MX-4P]
S111  D  CHERRY-MX-4P  [CHERRY-MX-4P]
S112  E  CHERRY-MX-4P  [CHERRY-MX-4P]
S113  F  CHERRY-MX-4P  [CHERRY-MX-4P]
S114  /  CHERRY-MX-4P  [CHERRY-MX-4P]
S115  A  CHERRY-MX-4P  [CHERRY-MX-4P]
S116  B  CHERRY-MX-4P  [CHERRY-MX-4P]
S117  C  CHERRY-MX-4P  [CHERRY-MX-4P]
S118  *  CHERRY-MX-4P  [CHERRY-MX-4P]
S119  7  CHERRY-MX-4P  [CHERRY-MX-4P]
S120  8  CHERRY-MX-4P  [CHERRY-MX-4P]
S121  9  CHERRY-MX-4P  [CHERRY-MX-4P]
S122  -  CHERRY-MX-4P  [CHERRY-MX-4P]
S123  4  CHERRY-MX-4P  [CHERRY-MX-4P]
S124  5  CHERRY-MX-4P  [CHERRY-MX-4P]
S125  6  CHERRY-MX-4P  [CHERRY-MX-4P]
S126  +  CHERRY-MX-4P  [CHERRY-MX-4P]
S127  1  CHERRY-MX-4P  [CHERRY-MX-4P]
S128  2  CHERRY-MX-4P  [CHERRY-MX-4P]
S129  3  CHERRY-MX-4P  [CHERRY-MX-4P]
S130  NumEnter  CHERRY-MX-4P  [CHERRY-MX-4P]
S131  0  CHERRY-MX-4P  [CHERRY-MX-4P]
S132  00  CHERRY-MX-4P  [CHERRY-MX-4P]
S133  .  CHERRY-MX-4P  [CHERRY-MX-4P]
S134  NumLock  31-XX  [B3F-31XX]
SV1  FE09-1  [FE09]

### Nets
+5V: 3D1.16(VCC) C1.1 D136.A R4.2 R5.2 R6.2 R7.1 SV1.9 ; also sheet 3
COLN1: 3D2.12(A:O) SV1.2
COLN2: 3D2.6(B:O) J15.1
COLN3: 3D2.8(C:O) SV1.3
GND: 3D1.4(G2A) 3D1.5(G2B) 3D1.8(GND) 3D2.7(P:GND) C1.2 C2.2 LED1.K(C) SV1.1 ; also sheet 3
N$338: D112.A S134.1(P)
N$339: JA111.1 S111.SW2(PIN-2)
N$340: D113.A JB112.1
N$341: JB112.2 S112.SW1(PIN-1)
N$342: JA112.1 S112.SW2(PIN-2)
N$343: D111.A JB111.1
N$344: JB111.2 S111.SW1(PIN-1)
N$345: D114.A JB113.1
N$346: JB113.2 S113.SW1(PIN-1)
N$347: JA113.1 S113.SW2(PIN-2)
N$348: D115.A JB114.1
N$349: JB114.2 S114.SW1(PIN-1)
N$350: JA114.1 S114.SW2(PIN-2)
N$351: JB115.2 S115.SW1(PIN-1)
N$352: D116.A JB115.1
N$353: JA115.1 S115.SW2(PIN-2)
N$354: JA116.1 S116.SW2(PIN-2)
N$355: JB116.2 S116.SW1(PIN-1)
N$356: D117.A JB116.1
N$357: D118.A JB117.1
N$358: JB117.2 S117.SW1(PIN-1)
N$359: JA117.1 S117.SW2(PIN-2)
N$360: D119.A JB118.1
N$361: JB118.2 S118.SW1(PIN-1)
N$362: JA118.1 S118.SW2(PIN-2)
N$363: D120.A JB119.1
N$364: JB119.2 S119.SW1(PIN-1)
N$365: JA119.1 S119.SW2(PIN-2)
N$366: JB120.2 S120.SW1(PIN-1)
N$367: JA120.1 S120.SW2(PIN-2)
N$368: D121.A JB120.1
N$369: D122.A JB121.1
N$370: JB121.2 S121.SW1(PIN-1)
N$371: JA121.1 S121.SW2(PIN-2)
N$372: D123.A JB122.1
N$373: JB122.2 S122.SW1(PIN-1)
N$374: JA122.1 S122.SW2(PIN-2)
N$375: D124.A JB123.1
N$376: JB123.2 S123.SW1(PIN-1)
N$377: JA123.1 S123.SW2(PIN-2)
N$378: JB124.2 S124.SW1(PIN-1)
N$379: D125.A JB124.1
N$380: JA124.1 S124.SW2(PIN-2)
N$381: D126.A JB125.1
N$382: JB125.2 S125.SW1(PIN-1)
N$383: JA125.1 S125.SW2(PIN-2)
N$384: D127.A JB126.1
N$385: JB126.2 S126.SW1(PIN-1)
N$386: JA126.1 S126.SW2(PIN-2)
N$387: JB130.2 S107B1.SW1(PIN-1) S130.SW1(PIN-1)
N$388: JA130.1 S107B1.SW2(PIN-2) S130.SW2(PIN-2)
N$389: D128.A JB127.1
N$390: JB127.2 S127.SW1(PIN-1)
N$391: JA127.1 S127.SW2(PIN-2)
N$392: JB128.2 S128.SW1(PIN-1)
N$393: D129.A JB128.1
N$394: JA128.1 S128.SW2(PIN-2)
N$395: D130.A JB129.1
N$396: JB129.2 S129.SW1(PIN-1)
N$397: JA129.1 S129.SW2(PIN-2)
N$398: JB131.2 S131.SW1(PIN-1)
N$399: JA131.1 S131.SW2(PIN-2)
N$400: D132.A JB131.1
N$401: JB132.2 S132.SW1(PIN-1)
N$402: D133.A JB132.1
N$403: JA132.1 S132.SW2(PIN-2)
N$404: D134.A JB133.1
N$405: JB133.2 S133.SW1(PIN-1)
N$406: JA133.1 S133.SW2(PIN-2)
N$407: 3D2.3(B:I0) 3D2.4(B:I1) 3D2.5(B:I2) JA112.2 JA116.2 JA120.2 JA124.2 JA125.2 JA128.2 JA129.2 JA133.2 R5.1
N$408: D111.C D117.C D118.C J9.2
N$409: D123.C D126.C D128.C J4.1
N$410: 3D2.1(A:I0) 3D2.2(A:I1) 3D2.13(A:I2) JA111.2 JA115.2 JA119.2 JA123.2 JA127.2 JA131.2 JA132.2 R4.1 S134.2(S)
N$411: 3D1.10(Y5) D112.C D113.C D114.C
N$412: 3D1.11(Y4) D115.C J7.2
N$413: 3D1.12(Y3) D119.C J3.2
N$414: 3D1.14(Y1) D127.C D130.C D132.C
N$415: D116.C D121.C D122.C J11.2
N$416: D131.A J8.2 JA113.2 JA114.2 JA117.2 JA118.2 JA121.2 JA122.2 JA126.2
N$417: D131.C JB130.1
N$418: D124.C D129.C J2.1
N$419: J1.1 J2.2
N$420: J1.2 J3.1
N$421: 3D1.13(Y2) J4.2
N$422: D120.C D125.C J5.1
N$423: J6.2 J7.1
N$424: J5.2 J6.1
N$425: 3D2.9(C:I0) 3D2.10(C:I1) 3D2.11(C:I2) J14.1 R6.1
N$426: 3D1.7(Y7) J10.1
N$427: J9.1 J10.2
N$428: J11.1 J12.1
N$429: J12.2 J13.1
N$430: 3D1.9(Y6) J13.2
N$431: 3D1.6(G1) R7.2
N$432: 3D1.1(A) SV1.8
N$433: 3D1.2(B) SV1.7
N$434: 3D1.3(C) SV1.6
N$435: LED1.A R8.2
N$436: J8.1 J14.2
N$437: J15.2 J16.1
N$438: J16.2 SV1.5
N$439: J17.2 SV1.4
N$440: J17.1 R8.1
N$441: D135.A D136.C
N$442: 3D2.14(P:VCC) C2.1 D135.C
SCK: 3D1.15(Y0) D133.C D134.C JA130.2
Unconnected: S107B1.D1(_D:D1) S107B1.D2(_D:D2) S107B1.LED1(_L:LED1) S107B1.LED2(_L:LED2) S111.D1(_D:D1) S111.D2(_D:D2) S111.LED1(_L:LED1) S111.LED2(_L:LED2) S112.D1(_D:D1) S112.D2(_D:D2) S112.LED1(_L:LED1) S112.LED2(_L:LED2) S113.D1(_D:D1) S113.D2(_D:D2) S113.LED1(_L:LED1) S113.LED2(_L:LED2) S114.D1(_D:D1) S114.D2(_D:D2) S114.LED1(_L:LED1) S114.LED2(_L:LED2) S115.D1(_D:D1) S115.D2(_D:D2) S115.LED1(_L:LED1) S115.LED2(_L:LED2) S116.D1(_D:D1) S116.D2(_D:D2) S116.LED1(_L:LED1) S116.LED2(_L:LED2) S117.D1(_D:D1) S117.D2(_D:D2) S117.LED1(_L:LED1) S117.LED2(_L:LED2) S118.D1(_D:D1) S118.D2(_D:D2) S118.LED1(_L:LED1) S118.LED2(_L:LED2) S119.D1(_D:D1) S119.D2(_D:D2) S119.LED1(_L:LED1) S119.LED2(_L:LED2) S120.D1(_D:D1) S120.D2(_D:D2) S120.LED1(_L:LED1) S120.LED2(_L:LED2) S121.D1(_D:D1) S121.D2(_D:D2) S121.LED1(_L:LED1) S121.LED2(_L:LED2) S122.D1(_D:D1) S122.D2(_D:D2) S122.LED1(_L:LED1) S122.LED2(_L:LED2) S123.D1(_D:D1) S123.D2(_D:D2) S123.LED1(_L:LED1) S123.LED2(_L:LED2) S124.D1(_D:D1) S124.D2(_D:D2) S124.LED1(_L:LED1) S124.LED2(_L:LED2) S125.D1(_D:D1) S125.D2(_D:D2) S125.LED1(_L:LED1) S125.LED2(_L:LED2) S126.D1(_D:D1) S126.D2(_D:D2) S126.LED1(_L:LED1) S126.LED2(_L:LED2) S127.D1(_D:D1) S127.D2(_D:D2) S127.LED1(_L:LED1) S127.LED2(_L:LED2) S128.D1(_D:D1) S128.D2(_D:D2) S128.LED1(_L:LED1) S128.LED2(_L:LED2) S129.D1(_D:D1) S129.D2(_D:D2) S129.LED1(_L:LED1) S129.LED2(_L:LED2) S130.D1(_D:D1) S130.D2(_D:D2) S130.LED1(_L:LED1) S130.LED2(_L:LED2) S131.D1(_D:D1) S131.D2(_D:D2) S131.LED1(_L:LED1) S131.LED2(_L:LED2) S132.D1(_D:D1) S132.D2(_D:D2) S132.LED1(_L:LED1) S132.LED2(_L:LED2) S133.D1(_D:D1) S133.D2(_D:D2) S133.LED1(_L:LED1) S133.LED2(_L:LED2)

## Sheet 3 of 3
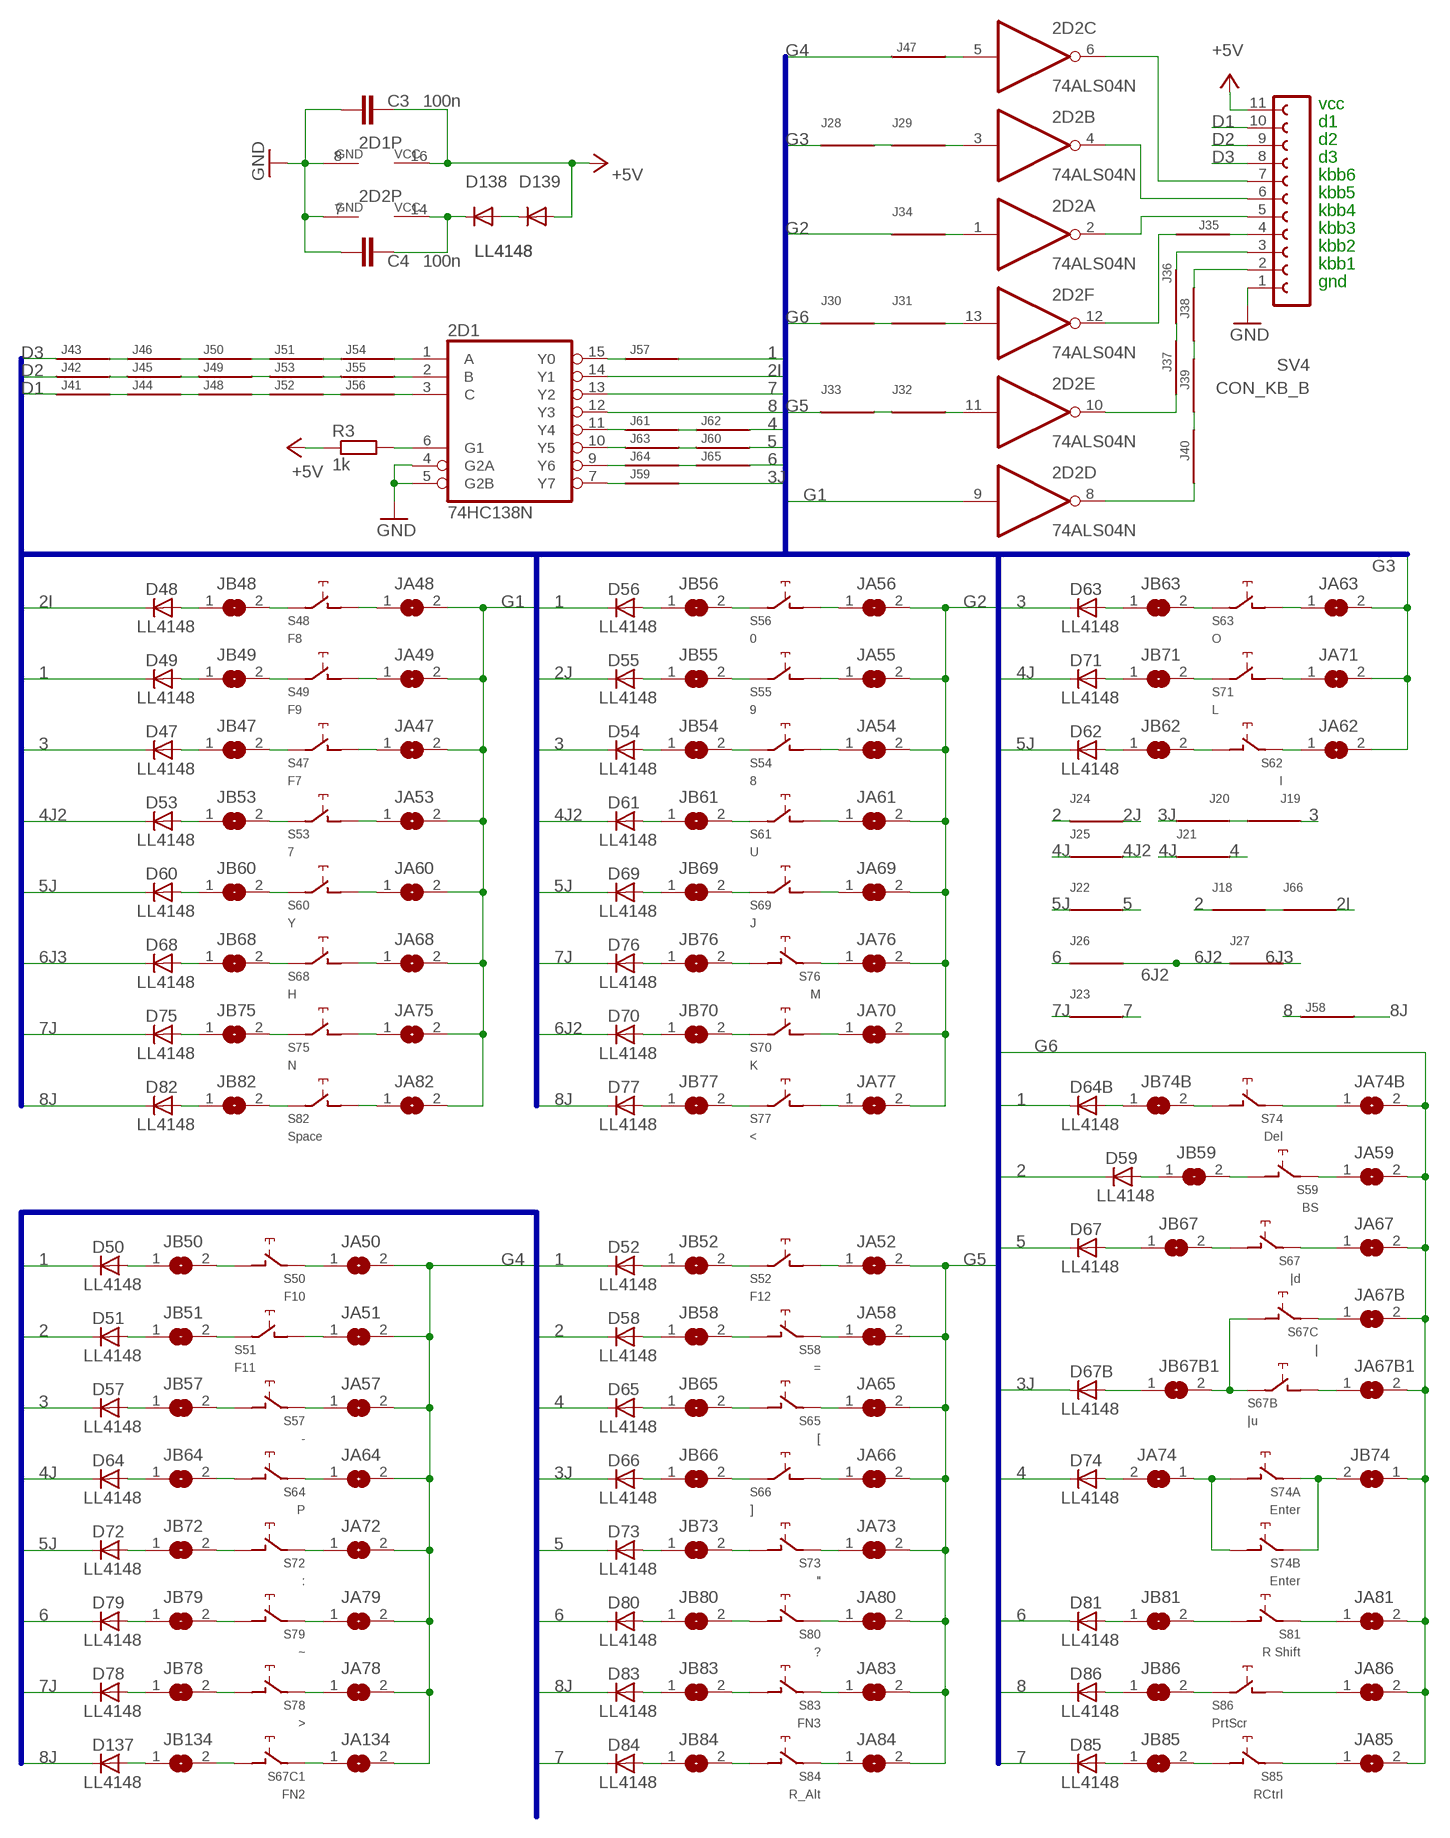
[diagram p3: schematic, sheet 3]

### Parts
2D1  74HC138N  74AC138N  [DIL16]
2D2  74ALS04N  [DIL14]
C3  100n  C-EUC0805  [C0805]
C4  100n  C-EUC0805  [C0805]
D47  LL4148  [SOD80C]
D48  LL4148  [SOD80C]
D49  LL4148  [SOD80C]
D50  LL4148  [SOD80C]
D51  LL4148  [SOD80C]
D52  LL4148  [SOD80C]
D53  LL4148  [SOD80C]
D54  LL4148  [SOD80C]
D55  LL4148  [SOD80C]
D56  LL4148  [SOD80C]
D57  LL4148  [SOD80C]
D58  LL4148  [SOD80C]
D59  LL4148  [SOD80C]
D60  LL4148  [SOD80C]
D61  LL4148  [SOD80C]
D62  LL4148  [SOD80C]
D63  LL4148  [SOD80C]
D64  LL4148  [SOD80C]
D64B  LL4148  [SOD80C]
D65  LL4148  [SOD80C]
D66  LL4148  [SOD80C]
D67  LL4148  [SOD80C]
D67B  LL4148  [SOD80C]
D68  LL4148  [SOD80C]
D69  LL4148  [SOD80C]
D70  LL4148  [SOD80C]
D71  LL4148  [SOD80C]
D72  LL4148  [SOD80C]
D73  LL4148  [SOD80C]
D74  LL4148  [SOD80C]
D75  LL4148  [SOD80C]
D76  LL4148  [SOD80C]
D77  LL4148  [SOD80C]
D78  LL4148  [SOD80C]
D79  LL4148  [SOD80C]
D80  LL4148  [SOD80C]
D81  LL4148  [SOD80C]
D82  LL4148  [SOD80C]
D83  LL4148  [SOD80C]
D84  LL4148  [SOD80C]
D85  LL4148  [SOD80C]
D86  LL4148  [SOD80C]
D137  LL4148  [SOD80C]
D138  LL4148  [SOD80C]
D139  LL4148  [SOD80C]
J18  J  [R1206W]
J19  J  [R1206W]
J20  J  [R1206W]
J21  J  [R1206W]
J22  J  [R1206W]
J23  J  [R1206W]
J24  J  [R1206W]
J25  J  [R1206W]
J26  J  [R1206W]
J27  J  [R1206W]
J28  J  [R1206W]
J29  J  [R1206W]
J30  J  [R1206W]
J31  J  [R1206W]
J32  J  [R1206W]
J33  J  [R1206W]
J34  J  [R1206W]
J35  J  [R1206W]
J36  J  [R1206W]
J37  J  [R1206W]
J38  J  [R1206W]
J39  J  [R1206W]
J40  J  [R1206W]
J41  J  [R1206W]
J42  J  [R1206W]
J43  J  [R1206W]
J44  J  [R1206W]
J45  J  [R1206W]
J46  J  [R1206W]
J47  J  [R1206W]
J48  J  [R1206W]
J49  J  [R1206W]
J50  J  [R1206W]
J51  J  [R1206W]
J52  J  [R1206W]
J53  J  [R1206W]
J54  J  [R1206W]
J55  J  [R1206W]
J56  J  [R1206W]
J57  J  [R1206W]
J58  J  [R1206W]
J59  J  [R1206W]
J60  J  [R1206W]
J61  J  [R1206W]
J62  J  [R1206W]
J63  J  [R1206W]
J64  J  [R1206W]
J65  J  [R1206W]
J66  J  [R1206W]
JA47  SJ  [SJ]
JA48  SJ  [SJ]
JA49  SJ  [SJ]
JA50  SJ  [SJ]
JA51  SJ  [SJ]
JA52  SJ  [SJ]
JA53  SJ  [SJ]
JA54  SJ  [SJ]
JA55  SJ  [SJ]
JA56  SJ  [SJ]
JA57  SJ  [SJ]
JA58  SJ  [SJ]
JA59  SJ  [SJ]
JA60  SJ  [SJ]
JA61  SJ  [SJ]
JA62  SJ  [SJ]
JA63  SJ  [SJ]
JA64  SJ  [SJ]
JA65  SJ  [SJ]
JA66  SJ  [SJ]
JA67  SJ  [SJ]
JA67B  SJ  [SJ]
JA67B1  SJ  [SJ]
JA68  SJ  [SJ]
JA69  SJ  [SJ]
JA70  SJ  [SJ]
JA71  SJ  [SJ]
JA72  SJ  [SJ]
JA73  SJ  [SJ]
JA74  SJ  [SJ]
JA74B  SJ  [SJ]
JA75  SJ  [SJ]
JA76  SJ  [SJ]
JA77  SJ  [SJ]
JA78  SJ  [SJ]
JA79  SJ  [SJ]
JA80  SJ  [SJ]
JA81  SJ  [SJ]
JA82  SJ  [SJ]
JA83  SJ  [SJ]
JA84  SJ  [SJ]
JA85  SJ  [SJ]
JA86  SJ  [SJ]
JA134  SJ  [SJ]
JB47  SJ  [SJ]
JB48  SJ  [SJ]
JB49  SJ  [SJ]
JB50  SJ  [SJ]
JB51  SJ  [SJ]
JB52  SJ  [SJ]
JB53  SJ  [SJ]
JB54  SJ  [SJ]
JB55  SJ  [SJ]
JB56  SJ  [SJ]
JB57  SJ  [SJ]
JB58  SJ  [SJ]
JB59  SJ  [SJ]
JB60  SJ  [SJ]
JB61  SJ  [SJ]
JB62  SJ  [SJ]
JB63  SJ  [SJ]
JB64  SJ  [SJ]
JB65  SJ  [SJ]
JB66  SJ  [SJ]
JB67  SJ  [SJ]
JB67B1  SJ  [SJ]
JB68  SJ  [SJ]
JB69  SJ  [SJ]
JB70  SJ  [SJ]
JB71  SJ  [SJ]
JB72  SJ  [SJ]
JB73  SJ  [SJ]
JB74  SJ  [SJ]
JB74B  SJ  [SJ]
JB75  SJ  [SJ]
JB76  SJ  [SJ]
JB77  SJ  [SJ]
JB78  SJ  [SJ]
JB79  SJ  [SJ]
JB80  SJ  [SJ]
JB81  SJ  [SJ]
JB82  SJ  [SJ]
JB83  SJ  [SJ]
JB84  SJ  [SJ]
JB85  SJ  [SJ]
JB86  SJ  [SJ]
JB134  SJ  [SJ]
R3  1k  R-EU_R0805  [R0805]
S47  F7  CHERRY-MX-4P  [CHERRY-MX-4P]
S48  F8  CHERRY-MX-4P  [CHERRY-MX-4P]
S49  F9  CHERRY-MX-4P  [CHERRY-MX-4P]
S50  F10  CHERRY-MX-4P  [CHERRY-MX-4P]
S51  F11  CHERRY-MX-4P  [CHERRY-MX-4P]
S52  F12  CHERRY-MX-4P  [CHERRY-MX-4P]
S53  7  CHERRY-MX-4P  [CHERRY-MX-4P]
S54  8  CHERRY-MX-4P  [CHERRY-MX-4P]
S55  9  CHERRY-MX-4P  [CHERRY-MX-4P]
S56  0  CHERRY-MX-4P  [CHERRY-MX-4P]
S57  -  CHERRY-MX-4P  [CHERRY-MX-4P]
S58  =  CHERRY-MX-4P  [CHERRY-MX-4P]
S59  BS  CHERRY-MX-4P  [CHERRY-MX-4P]
S60  Y  CHERRY-MX-4P  [CHERRY-MX-4P]
S61  U  CHERRY-MX-4P  [CHERRY-MX-4P]
S62  I  CHERRY-MX-4P  [CHERRY-MX-4P]
S63  O  CHERRY-MX-4P  [CHERRY-MX-4P]
S64  P  CHERRY-MX-4P  [CHERRY-MX-4P]
S65  [  CHERRY-MX-4P  [CHERRY-MX-4P]
S66  ]  CHERRY-MX-4P  [CHERRY-MX-4P]
S67  |d  CHERRY-MX-4P  [CHERRY-MX-4P]
S67B  |u  CHERRY-MX  [CHERRY-MX]
S67C  |  CHERRY-MX-4P  [CHERRY-MX-4P]
S67C1  FN2  CHERRY-MX-4P  [CHERRY-MX-4P]
S68  H  CHERRY-MX-4P  [CHERRY-MX-4P]
S69  J  CHERRY-MX-4P  [CHERRY-MX-4P]
S70  K  CHERRY-MX-4P  [CHERRY-MX-4P]
S71  L  CHERRY-MX-4P  [CHERRY-MX-4P]
S72  :  CHERRY-MX-4P  [CHERRY-MX-4P]
S73  "  CHERRY-MX-4P  [CHERRY-MX-4P]
S74  Del  CHERRY-MX-4P  [CHERRY-MX-4P]
S74A  Enter  CHERRY-MX-4P  [CHERRY-MX-4P]
S74B  Enter  CHERRY-MX  [CHERRY-MX]
S75  N  CHERRY-MX-4P  [CHERRY-MX-4P]
S76  M  CHERRY-MX-4P  [CHERRY-MX-4P]
S77  <  CHERRY-MX-4P  [CHERRY-MX-4P]
S78  >  CHERRY-MX-4P  [CHERRY-MX-4P]
S79  ~  CHERRY-MX-4P  [CHERRY-MX-4P]
S80  ?  CHERRY-MX-4P  [CHERRY-MX-4P]
S81  R Shift  CHERRY-MX-4P  [CHERRY-MX-4P]
S82  Space  CHERRY-MX-4P  [CHERRY-MX-4P]
S83  FN3  CHERRY-MX-4P  [CHERRY-MX-4P]
S84  R_Alt  CHERRY-MX-4P  [CHERRY-MX-4P]
S85  RCtrl  CHERRY-MX-4P  [CHERRY-MX-4P]
S86  PrtScr  CHERRY-MX-4P  [CHERRY-MX-4P]
SV4  CON_KB_B  FE12-1  [FE12]

### Nets
1: D49.C D50.C D52.C D56.C D64B.C J57.1
2: D51.C D58.C D59.C J18.2 J24.2
2I: 2D1.14(Y1) D48.C J66.1
2J: D55.C J24.1
3: D47.C D54.C D57.C D63.C J19.2
3J: D66.C D67B.C J20.1 J59.1
4: D65.C D74.C J21.1 J62.1
4J: D64.C D71.C J21.2 J25.2
4J2: D53.C D61.C J25.1
5: D67.C D73.C J22.1 J60.1
5J: D60.C D62.C D69.C D72.C J22.2
6: D79.C D80.C D81.C J26.2 J65.1
6J2: D70.C J26.1 J27.2
6J3: D68.C J27.1
7: 2D1.13(Y2) D84.C D85.C J23.1
7J: D75.C D76.C D78.C J23.2
8: 2D1.12(Y3) D86.C J58.2
8J: D77.C D82.C D83.C D137.C J58.1
+3VD: 2D2.14(P:VCC) C4.1 D138.C
+5V: 2D1.16(VCC) C3.1 D139.A R3.1 SV4.11 ; also sheet 2
D1: J41.2 SV4.10
D2: J42.2 SV4.9
D3: J43.2 SV4.8
G1: 2D2.9(D:I) JA47.2 JA48.2 JA49.2 JA53.2 JA60.2 JA68.2 JA75.2 JA82.2 ; also sheet 1
G2: J34.2 JA54.2 JA55.2 JA56.2 JA61.2 JA69.2 JA70.2 JA76.2 JA77.2 ; also sheet 1
G3: J28.2 JA62.2 JA63.2 JA71.2
G4: J47.2 JA50.2 JA51.2 JA57.2 JA64.2 JA72.2 JA78.2 JA79.2 JA134.2
G5: J33.2 JA52.2 JA58.2 JA65.2 JA66.2 JA73.2 JA80.2 JA83.2 JA84.2
G6: J30.2 JA59.2 JA67.2 JA67B1.2 JA67B.2 JA74B.2 JA81.2 JA85.2 JA86.2 JB74.1
GND: 2D1.4(G2A) 2D1.5(G2B) 2D1.8(GND) 2D2.7(P:GND) C3.2 C4.2 SV4.1 ; also sheet 2
N$70: JA67B1.1 S67B.SW2(PIN-2)
N$71: JB52.2 S52.SW1(PIN-1)
N$84: JB63.2 S63.SW1(PIN-1)
N$89: JA67B.1 S67C.SW1(PIN-1)
N$94: JB74.2 S74A.SW1(PIN-1) S74B.SW1(PIN-1)
N$97: JA74.1 S74A.SW2(PIN-2) S74B.SW2(PIN-2)
N$112: JB47.2 S47.SW1(PIN-1)
N$127: JB53.2 S53.SW1(PIN-1)
N$152: JB74B.2 S74.SW2(PIN-2)
N$153: JB60.2 S60.SW1(PIN-1)
N$154: JB68.2 S68.SW1(PIN-1)
N$155: JB75.2 S75.SW1(PIN-1)
N$156: JB82.2 S82.SW1(PIN-1)
N$157: JB48.2 S48.SW1(PIN-1)
N$158: JB54.2 S54.SW1(PIN-1)
N$159: JB61.2 S61.SW1(PIN-1)
N$160: JB69.2 S69.SW1(PIN-1)
N$161: JB67B1.2 S67B.SW1(PIN-1) S67C.SW2(PIN-2)
N$162: JA134.1 S67C1.SW1(PIN-1)
N$163: JB49.2 S49.SW1(PIN-1)
N$164: JB55.2 S55.SW1(PIN-1)
N$165: JB134.2 S67C1.SW2(PIN-2)
N$166: JB70.2 S70.SW1(PIN-1)
N$167: JB77.2 S77.SW1(PIN-1)
N$168: D137.A JB134.1
N$169: JB50.2 S50.SW2(PIN-2)
N$170: JB56.2 S56.SW1(PIN-1)
N$171: D67B.A JB67B1.1
N$172: JB78.2 S78.SW2(PIN-2)
N$173: JB85.2 S85.SW2(PIN-2)
N$174: JB51.2 S51.SW1(PIN-1)
N$175: JB83.2 S83.SW2(PIN-2)
N$176: JB73.2 S73.SW2(PIN-2)
N$177: JA73.1 S73.SW1(PIN-1)
N$178: JB79.2 S79.SW2(PIN-2)
N$179: JB57.2 S57.SW2(PIN-2)
N$180: JB58.2 S58.SW2(PIN-2)
N$181: JB65.2 S65.SW2(PIN-2)
N$182: JA80.1 S80.SW1(PIN-1)
N$183: JB59.2 S59.SW2(PIN-2)
N$184: JB66.2 S66.SW1(PIN-1)
N$185: JB67.2 S67.SW2(PIN-2)
N$186: JB81.2 S81.SW2(PIN-2)
N$187: D47.A JB47.1
N$188: D53.A JB53.1
N$189: D60.A JB60.1
N$190: D68.A JB68.1
N$191: D75.A JB75.1
N$192: D82.A JB82.1
N$193: D48.A JB48.1
N$194: D54.A JB54.1
N$195: D61.A JB61.1
N$196: D69.A JB69.1
N$197: D76.A JB76.1
N$198: D83.A JB83.1
N$199: D49.A JB49.1
N$200: D55.A JB55.1
N$201: D62.A JB62.1
N$202: D70.A JB70.1
N$203: D77.A JB77.1
N$204: D84.A JB84.1
N$205: D50.A JB50.1
N$206: D56.A JB56.1
N$207: D63.A JB63.1
N$208: D71.A JB71.1
N$209: D78.A JB78.1
N$210: D85.A JB85.1
N$211: D51.A JB51.1
N$212: D57.A JB57.1
N$213: D64.A JB64.1
N$214: D72.A JB72.1
N$215: D79.A JB79.1
N$216: D86.A JB86.1
N$217: D52.A JB52.1
N$218: D58.A JB58.1
N$219: D65.A JB65.1
N$220: D73.A JB73.1
N$221: D80.A JB80.1
N$222: D59.A JB59.1
N$223: D66.A JB66.1
N$224: D67.A JB67.1
N$225: D74.A JA74.2
N$226: D81.A JB81.1
N$227: JA66.1 S66.SW2(PIN-2)
N$228: JA47.1 S47.SW2(PIN-2)
N$229: JA53.1 S53.SW2(PIN-2)
N$230: JA60.1 S60.SW2(PIN-2)
N$231: JA68.1 S68.SW2(PIN-2)
N$232: JA75.1 S75.SW2(PIN-2)
N$233: JA82.1 S82.SW2(PIN-2)
N$234: JA48.1 S48.SW2(PIN-2)
N$235: JA54.1 S54.SW2(PIN-2)
N$236: JA61.1 S61.SW2(PIN-2)
N$237: JA69.1 S69.SW2(PIN-2)
N$238: JA57.1 S57.SW1(PIN-1)
N$239: JA83.1 S83.SW1(PIN-1)
N$240: JA49.1 S49.SW2(PIN-2)
N$241: JA55.1 S55.SW2(PIN-2)
N$242: JA64.1 S64.SW1(PIN-1)
N$243: JA70.1 S70.SW2(PIN-2)
N$244: JA77.1 S77.SW2(PIN-2)
N$245: JB80.2 S80.SW2(PIN-2)
N$246: JA50.1 S50.SW1(PIN-1)
N$247: JA56.1 S56.SW2(PIN-2)
N$248: JA63.1 S63.SW2(PIN-2)
N$249: J19.1 J20.2
N$250: JA78.1 S78.SW1(PIN-1)
N$251: JA85.1 S85.SW1(PIN-1)
N$252: JA51.1 S51.SW2(PIN-2)
N$253: JB64.2 S64.SW2(PIN-2)
N$254: JB72.2 S72.SW2(PIN-2)
N$255: JA72.1 S72.SW1(PIN-1)
N$256: JA79.1 S79.SW1(PIN-1)
N$257: JB62.2 S62.SW2(PIN-2)
N$258: JA52.1 S52.SW2(PIN-2)
N$259: JA65.1 S65.SW1(PIN-1)
N$260: JA58.1 S58.SW1(PIN-1)
N$261: JB84.2 S84.SW2(PIN-2)
N$262: JA84.1 S84.SW1(PIN-1)
N$263: JA81.1 S81.SW1(PIN-1)
N$264: JA67.1 S67.SW1(PIN-1)
N$265: JA59.1 S59.SW1(PIN-1)
N$266: D64B.A JB74B.1
N$267: JA74B.1 S74.SW1(PIN-1)
N$480: JA62.1 S62.SW1(PIN-1)
N$481: JB71.2 S71.SW1(PIN-1)
N$482: JA71.1 S71.SW2(PIN-2)
N$483: 2D1.6(G1) R3.2
N$484: JB76.2 S76.SW2(PIN-2)
N$485: JA76.1 S76.SW1(PIN-1)
N$486: 2D2.6(C:O) SV4.7
N$487: 2D2.4(B:O) SV4.6
N$488: 2D2.2(A:O) SV4.5
N$489: 2D2.12(F:O) J35.2
N$490: 2D2.8(D:O) J40.2
N$491: J28.1 J29.2
N$492: 2D2.3(B:I) J29.1
N$493: J30.1 J31.2
N$494: 2D2.13(F:I) J31.1
N$495: J32.2 J33.1
N$496: 2D2.11(E:I) J32.1
N$497: 2D2.1(A:I) J34.1
N$498: J35.1 SV4.4
N$499: J36.1 SV4.3
N$500: J36.2 J37.1
N$501: 2D2.10(E:O) J37.2
N$502: J38.1 SV4.2
N$503: J38.2 J39.1
N$504: J39.2 J40.1
N$505: D138.A D139.C
N$506: J41.1 J44.2
N$507: J42.1 J45.2
N$508: J43.1 J46.2
N$509: 2D2.5(C:I) J47.1
N$510: J44.1 J48.2
N$511: J45.1 J49.2
N$512: J46.1 J50.2
N$513: J50.1 J51.2
N$514: J48.1 J52.2
N$515: J49.1 J53.2
N$516: J51.1 J54.2
N$517: J53.1 J55.2
N$518: J52.1 J56.2
N$519: 2D1.1(A) J54.1
N$520: 2D1.2(B) J55.1
N$521: 2D1.3(C) J56.1
N$522: 2D1.15(Y0) J57.2
N$523: JB86.2 S86.SW1(PIN-1)
N$524: JA86.1 S86.SW2(PIN-2)
N$525: 2D1.7(Y7) J59.2
N$526: J61.1 J62.2
N$527: 2D1.11(Y4) J61.2
N$528: J60.2 J63.1
N$529: J64.1 J65.2
N$530: 2D1.9(Y6) J64.2
N$531: 2D1.10(Y5) J63.2
N$532: J18.1 J66.2
Unconnected: S47.D1(_D:D1) S47.D2(_D:D2) S47.LED1(_L:LED1) S47.LED2(_L:LED2) S48.D1(_D:D1) S48.D2(_D:D2) S48.LED1(_L:LED1) S48.LED2(_L:LED2) S49.D1(_D:D1) S49.D2(_D:D2) S49.LED1(_L:LED1) S49.LED2(_L:LED2) S50.D1(_D:D1) S50.D2(_D:D2) S50.LED1(_L:LED1) S50.LED2(_L:LED2) S51.D1(_D:D1) S51.D2(_D:D2) S51.LED1(_L:LED1) S51.LED2(_L:LED2) S52.D1(_D:D1) S52.D2(_D:D2) S52.LED1(_L:LED1) S52.LED2(_L:LED2) S53.D1(_D:D1) S53.D2(_D:D2) S53.LED1(_L:LED1) S53.LED2(_L:LED2) S54.D1(_D:D1) S54.D2(_D:D2) S54.LED1(_L:LED1) S54.LED2(_L:LED2) S55.D1(_D:D1) S55.D2(_D:D2) S55.LED1(_L:LED1) S55.LED2(_L:LED2) S56.D1(_D:D1) S56.D2(_D:D2) S56.LED1(_L:LED1) S56.LED2(_L:LED2) S57.D1(_D:D1) S57.D2(_D:D2) S57.LED1(_L:LED1) S57.LED2(_L:LED2) S58.D1(_D:D1) S58.D2(_D:D2) S58.LED1(_L:LED1) S58.LED2(_L:LED2) S59.D1(_D:D1) S59.D2(_D:D2) S59.LED1(_L:LED1) S59.LED2(_L:LED2) S60.D1(_D:D1) S60.D2(_D:D2) S60.LED1(_L:LED1) S60.LED2(_L:LED2) S61.D1(_D:D1) S61.D2(_D:D2) S61.LED1(_L:LED1) S61.LED2(_L:LED2) S62.D1(_D:D1) S62.D2(_D:D2) S62.LED1(_L:LED1) S62.LED2(_L:LED2) S63.D1(_D:D1) S63.D2(_D:D2) S63.LED1(_L:LED1) S63.LED2(_L:LED2) S64.D1(_D:D1) S64.D2(_D:D2) S64.LED1(_L:LED1) S64.LED2(_L:LED2) S65.D1(_D:D1) S65.D2(_D:D2) S65.LED1(_L:LED1) S65.LED2(_L:LED2) S66.D1(_D:D1) S66.D2(_D:D2) S66.LED1(_L:LED1) S66.LED2(_L:LED2) S67.D1(_D:D1) S67.D2(_D:D2) S67.LED1(_L:LED1) S67.LED2(_L:LED2) S67C1.D1(_D:D1) S67C1.D2(_D:D2) S67C1.LED1(_L:LED1) S67C1.LED2(_L:LED2) S67C.D1(_D:D1) S67C.D2(_D:D2) S67C.LED1(_L:LED1) S67C.LED2(_L:LED2) S68.D1(_D:D1) S68.D2(_D:D2) S68.LED1(_L:LED1) S68.LED2(_L:LED2) S69.D1(_D:D1) S69.D2(_D:D2) S69.LED1(_L:LED1) S69.LED2(_L:LED2) S70.D1(_D:D1) S70.D2(_D:D2) S70.LED1(_L:LED1) S70.LED2(_L:LED2) S71.D1(_D:D1) S71.D2(_D:D2) S71.LED1(_L:LED1) S71.LED2(_L:LED2) S72.D1(_D:D1) S72.D2(_D:D2) S72.LED1(_L:LED1) S72.LED2(_L:LED2) S73.D1(_D:D1) S73.D2(_D:D2) S73.LED1(_L:LED1) S73.LED2(_L:LED2) S74.D1(_D:D1) S74.D2(_D:D2) S74.LED1(_L:LED1) S74.LED2(_L:LED2) S74A.D1(_D:D1) S74A.D2(_D:D2) S74A.LED1(_L:LED1) S74A.LED2(_L:LED2) S75.D1(_D:D1) S75.D2(_D:D2) S75.LED1(_L:LED1) S75.LED2(_L:LED2) S76.D1(_D:D1) S76.D2(_D:D2) S76.LED1(_L:LED1) S76.LED2(_L:LED2) S77.D1(_D:D1) S77.D2(_D:D2) S77.LED1(_L:LED1) S77.LED2(_L:LED2) S78.D1(_D:D1) S78.D2(_D:D2) S78.LED1(_L:LED1) S78.LED2(_L:LED2) S79.D1(_D:D1) S79.D2(_D:D2) S79.LED1(_L:LED1) S79.LED2(_L:LED2) S80.D1(_D:D1) S80.D2(_D:D2) S80.LED1(_L:LED1) S80.LED2(_L:LED2) S81.D1(_D:D1) S81.D2(_D:D2) S81.LED1(_L:LED1) S81.LED2(_L:LED2) S82.D1(_D:D1) S82.D2(_D:D2) S82.LED1(_L:LED1) S82.LED2(_L:LED2) S83.D1(_D:D1) S83.D2(_D:D2) S83.LED1(_L:LED1) S83.LED2(_L:LED2) S84.D1(_D:D1) S84.D2(_D:D2) S84.LED1(_L:LED1) S84.LED2(_L:LED2) S85.D1(_D:D1) S85.D2(_D:D2) S85.LED1(_L:LED1) S85.LED2(_L:LED2) S86.D1(_D:D1) S86.D2(_D:D2) S86.LED1(_L:LED1) S86.LED2(_L:LED2)

### Buses
1,2,3,4,5,6,7,8,3J,4J,5J,6J,7J,8J,4J2,5J2,6J2,6J3,8J2,2I,2J,G[1..6],D[1..3]

### Notes on the sheet
- vcc
- d1
- d2
- d3
- kbb6
- kbb5
- kbb4
- kbb3
- kbb2
- kbb1
- gnd

## Power pins joined to a net without a drawn wire
AVCC: IC1.18(AVCC)
GND: IC1.3(GND) IC1.5(GND) IC1.21(GND)
VCC: IC1.4(VCC) IC1.6(VCC)

## Library data of the parts
1S1 1S1O = con-lsta:FE10-1: FEMALE HEADER; OC_FARNELL: unknown; OC_NEWARK: unknown
1S2 1S2O 1S3 1S3O = con-lsta:FE08-1: FEMALE HEADER; OC_FARNELL: unknown; OC_NEWARK: unknown
1S4 1S4O = con-lsta:FE05-1: FEMALE HEADER; OC_FARNELL: unknown; OC_NEWARK: unknown
2D1 = detali2:74*138: 3-line to 8-line DECODER/DEMULTIPLEXER
2D2 = detali2:74*04: Hex INVERTER
3D1 = detali:74*138: 3-line to 8-line DECODER/DEMULTIPLEXER
3D2 = detali:74*10: Triple 3-input NAND gate
C1-C4 = rcl:C-EU: CAPACITOR, European symbol
D1-D64 D64B D65-D67 D67B D68-D139 = detali:LL4148: DIODE high speed
HL1-HL4 = led:RGB2X5: DUO LED 2 colors, 5 mm, round
IC1 = atmel:MEGA8: MICROCONTROLLER 8 Kbytes FLASH, 1 kbytes SRAM, 512 bytes EEPROM, USART, 6-channel 10 bit ADC, 2-channel 8 bit ADC Pin compatible with Atmega48, ATMega88, ATMega168 Source: avr.lbr; MPN: ATMEGA8-16AU; OC_FARNELL: 9171371; OC_NEWARK: 73M8863
J1-J17 = detali:J
J18-J66 = detali2:J
JA1-JA12 JB2 JB4-JB17 = jumper:SJ: SMD solder JUMPER
JA13-JA67 JA67B JA67B1 JA68-JA74 JA74B JA75-JA134 JB1 JB3 JB18-JB67 JB67B1 JB68-JB74 JB74B JB75-JB134 = detali:SJ: SMD solder JUMPER
LED1 = detali:LED: LED OSRAM: - CHIPLED LG R971, LG N971, LY N971, LG Q971, LY Q971, LO R971, LY R971 LH N974, LH R974 LS Q976, LO Q976, LY Q976 LO Q996 - Hyper CHIPLED LW Q18S LB Q993, LB Q99A, LB R99A - SideLED LS A670, LO A670, LY A670, LG A670, LP A670 LB A673, LV A673, LT A673, LW A673 LH A674 LY A675 LS A676, LA A676, LO A676, LY A676, LW A676 LS A679, LY A679, LG A679 - Hyper Micro SIDELED® LS Y876, LA Y876, LO Y876, LY Y876 LT Y87S - SmartLED LW L88C, LW L88S LB L89C, LB L89S, LG L890 LS L89K, LO L89K, LY L89K LS L896, LA L896, LO L896, LY L896 - TOPLED LS T670, LO T670, LY T670, LG T670, LP T670 LSG T670, LSP T670, LSY T670, LOP T670, LYG T670 LG T671, LOG T671, LSG T671 LB T673, LV T673, LT T673, LW T673 LH T674 LS T676, LA T676, LO T676, LY T676, LB T676, LH T676, LSB T676, LW T676 LB T67C, LV T67C, LT T67C, LS T67K, LO T67K, LY T67K, LW E67C LS E67B, LA E67B, LO E67B, LY E67B, LB E67C, LV E67C, LT E67C LW T67C LS T679, LY T679, LG T679 LS T770, LO T770, LY T770, LG T770, LP T770 LB T773, LV T773, LT T773, LW T773 LH T774 LS E675, LA E675, LY E675, LS T675 LS T776, LA T776, LO T776, LY T776, LB T776 LHGB T686 LT T68C, LB T68C - Hyper Mini TOPLED® LB M676 - Mini TOPLED Santana® LG M470 LS M47K, LO M47K, LY M47K Source: http://www.osram.convergy.de LUXEON: - LUMILED® LXK2-PW12-R00, LXK2-PW12-S00, LXK2-PW14-U00, LXK2-PW14-V00 LXK2-PM12-R00, LXK2-PM12-S00, LXK2-PM14-U00 LXK2-PE12-Q00, LXK2-PE12-R00, LXK2-PE12-S00, LXK2-PE14-T00, LXK2-PE14-U00 LXK2-PB12-K00, LXK2-PB12-L00, LXK2-PB12-M00, LXK2-PB14-N00, LXK2-PB14-P00, LXK2-PB14-Q00 LXK2-PR12-L00, LXK2-PR12-M00, LXK2-PR14-Q00, LXK2-PR14-R00 LXK2-PD12-Q00, LXK2-PD12-R00, LXK2-PD12-S00 LXK2-PH12-R00, LXK2-PH12-S00 LXK2-PL12-P00, LXK2-PL12-Q00, LXK2-PL12-R00 Source: www.luxeon.com KINGBRIGHT: KA-3528ASYC Source: www.kingbright.com
R1-R8 = rcl:R-EU_: RESISTOR, European symbol
S1-S3 S43 = cherrymx:CHERRY-MX-LED: Cherry MX series keyswitch with LED
S4 S27 = cherrymx:CHERRY_MX
S5-S26 S28-S37 S37B S37B1 S38-S42 S44-S46 S67B S74B S107B = cherrymx:CHERRY-MX: Cherry MX series keyswitch
S47-S67 S67C S67C1 S68-S74 S74A S75-S107 S107B1 S108-S133 = cherrymx:CHERRY-MX-4P
S134 = detali:31-XX: OMRON SWITCH; MPN: B3F-3100; OC_FARNELL: 959704; OC_NEWARK: 36M3582
SV1 = detali:FE09-1: FEMALE HEADER; OC_FARNELL: unknown; OC_NEWARK: unknown
SV2 = con-lsta:FE06-1: FEMALE HEADER; OC_FARNELL: unknown; OC_NEWARK: unknown
SV3 = con-lsta:FE07-1: FEMALE HEADER; OC_FARNELL: unknown; OC_NEWARK: unknown
SV4 = detali2:FE12-1: FEMALE HEADER; OC_FARNELL: unknown; OC_NEWARK: unknown